# Altium project AWH6_V10.PrjPcb (part 1 of 3)
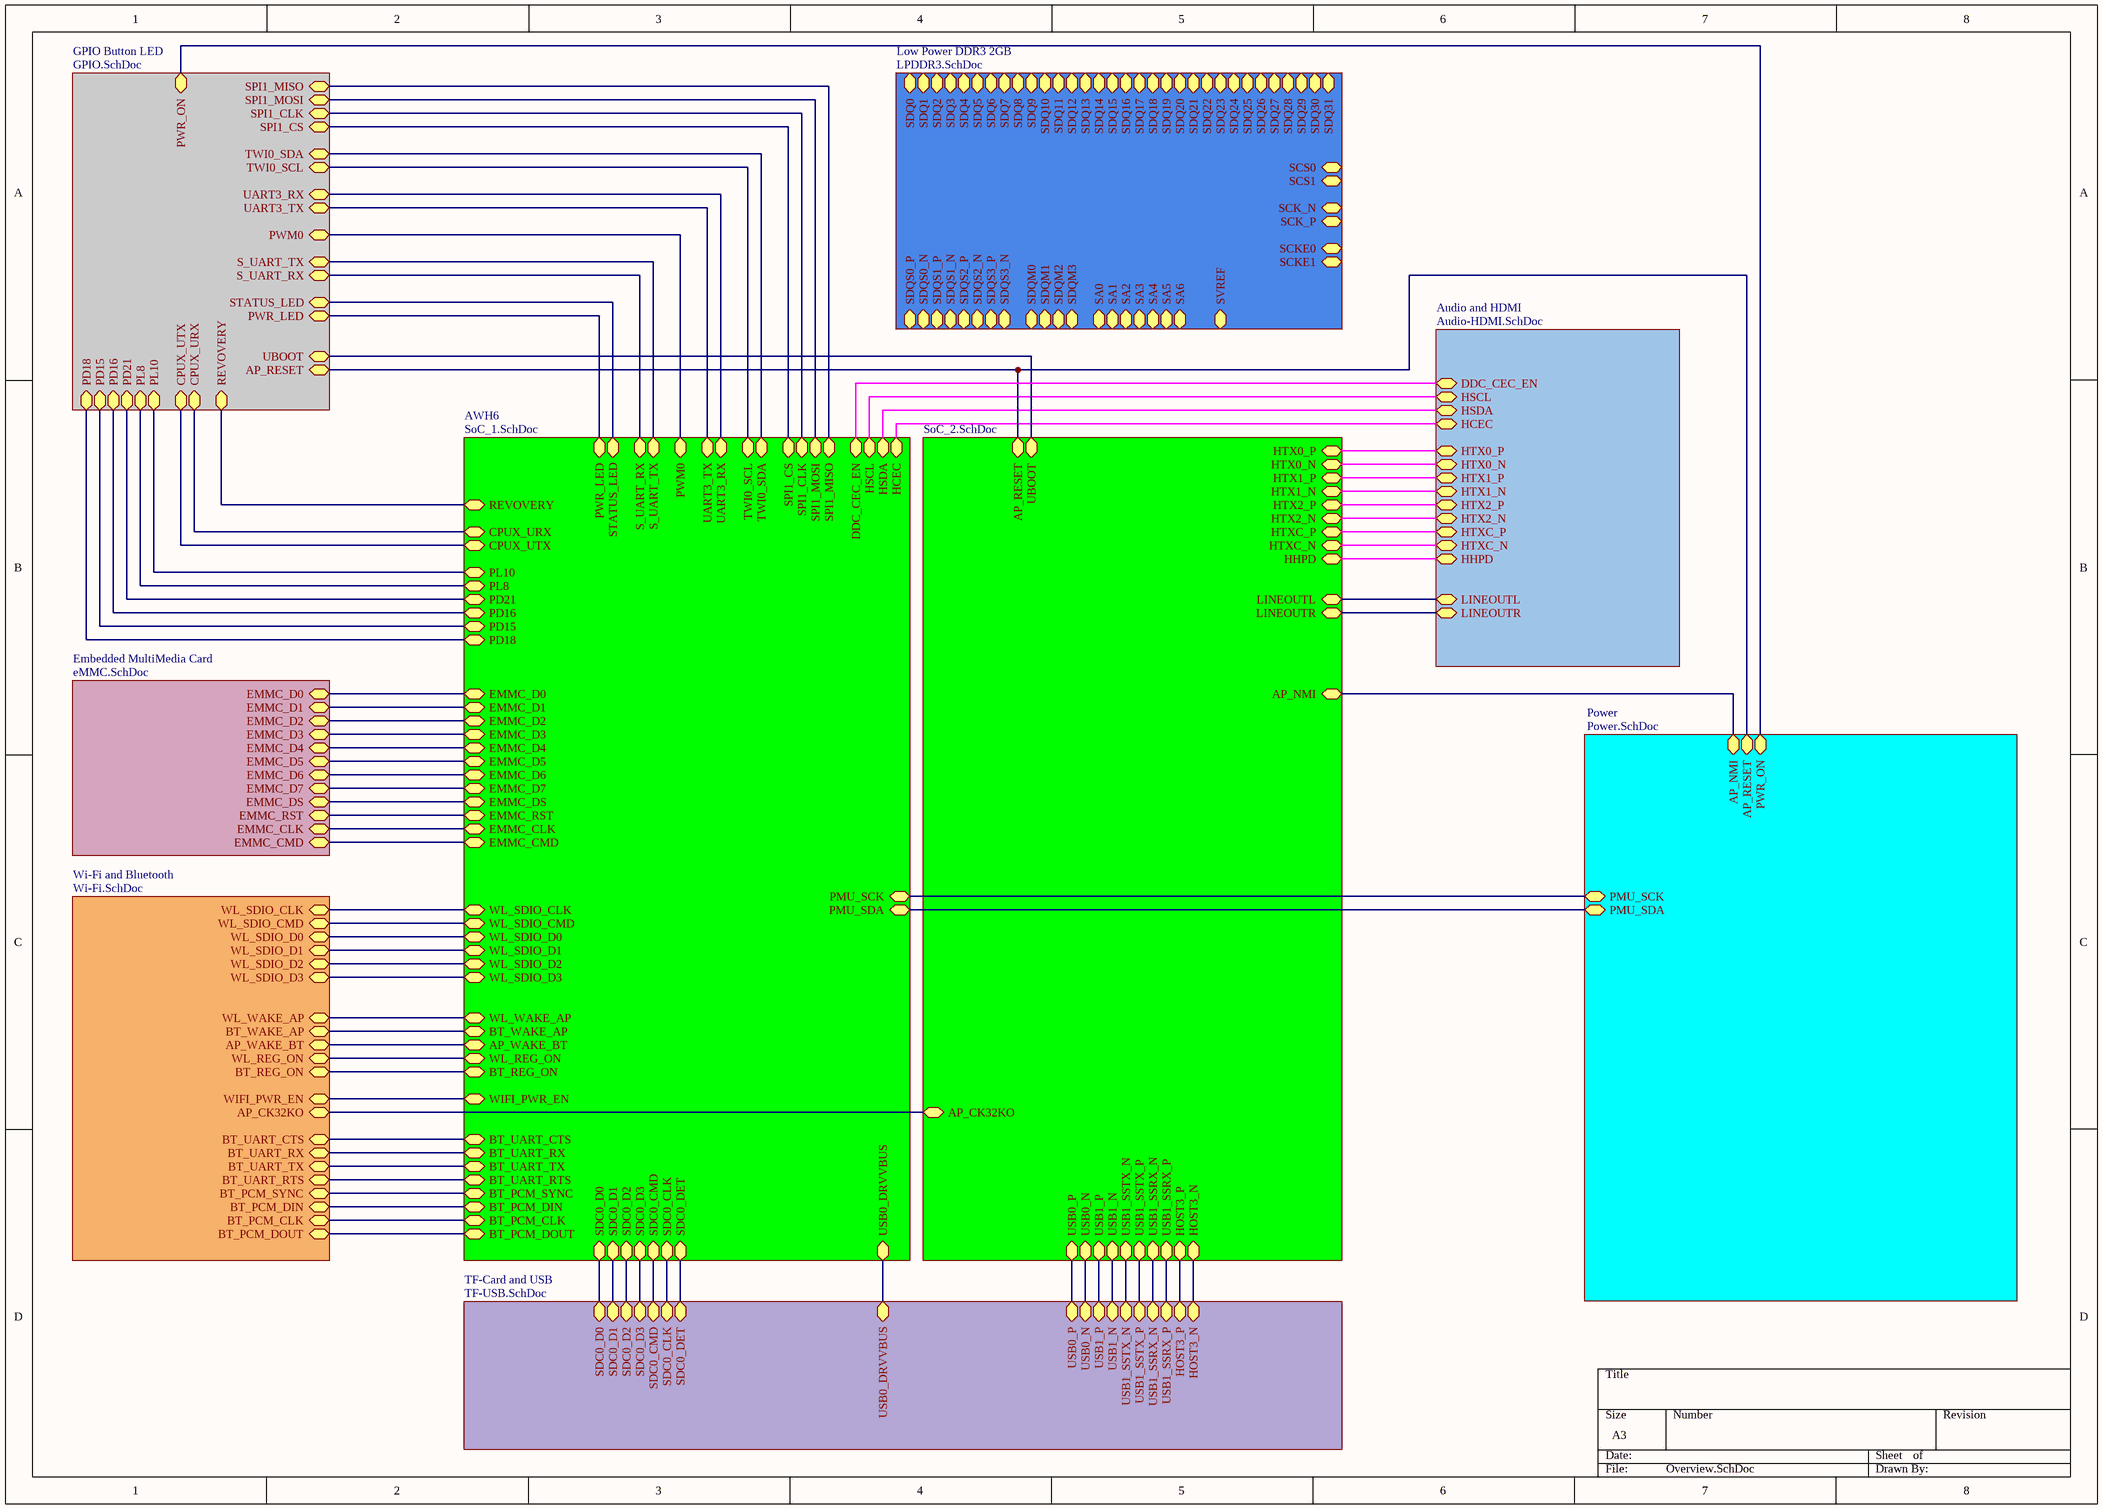
[diagram p0: Overview.SchDoc]
10 sheets, 321 parts. Net scope: global (net labels, ports and power ports of the same name join across sheets).
Board file: PCB1.PcbDoc
Sheets:
  Overview.SchDoc
    Low Power DDR3 2GB = LPDDR3.SchDoc
    AWH6 = SoC_1.SchDoc
    Embedded MultiMedia Card = eMMC.SchDoc
    Power = Power.SchDoc
    TF-Card and USB = TF-USB.SchDoc
    Audio and HDMI = Audio-HDMI.SchDoc
    Wi-Fi and Bluetooth = Wi-Fi.SchDoc
    U_MPU_2 = SoC_2.SchDoc
    GPIO Button LED = GPIO.SchDoc

## Sheet Overview.SchDoc
size A3; SheetNumber: 1; SheetTotal: 10

### Sub-sheets
Audio and HDMI = Audio-HDMI.SchDoc: DDC_CEC_EN (bidir), HSCL (bidir), HSDA (bidir), HCEC (bidir), LINEOUTL (bidir), LINEOUTR (bidir), HTX0_P (bidir), HTX0_N (bidir), HTX1_P (bidir), HTX1_N (bidir), HTX2_P (bidir), HTX2_N (bidir), HTXC_P (bidir), HTXC_N (bidir), HHPD (bidir)
AWH6 = SoC_1.SchDoc: DDC_CEC_EN (bidir), HSCL (bidir), HSDA (bidir), HCEC (bidir), WL_SDIO_CLK (bidir), WL_SDIO_CMD (bidir), WL_SDIO_D0 (bidir), WL_SDIO_D1 (bidir), WL_SDIO_D2 (bidir), WL_SDIO_D3 (bidir), WL_WAKE_AP (bidir), BT_WAKE_AP (bidir), AP_WAKE_BT (bidir), WL_REG_ON (bidir), BT_REG_ON (bidir), EMMC_D0 (bidir), EMMC_D1 (bidir), EMMC_D2 (bidir), EMMC_D3 (bidir), EMMC_D4 (bidir), EMMC_D5 (bidir), EMMC_D6 (bidir), EMMC_D7 (bidir), EMMC_DS (bidir), SDC0_D0 (bidir), SDC0_D1 (bidir), SDC0_D2 (bidir), SDC0_D3 (bidir), SDC0_CMD (bidir), SDC0_CLK (bidir), SDC0_DET (bidir), USB0_DRVVBUS (bidir), BT_UART_CTS (bidir), BT_UART_RX (bidir), BT_UART_TX (bidir), BT_UART_RTS (bidir), BT_PCM_SYNC (bidir), BT_PCM_DIN (bidir), BT_PCM_CLK (bidir), BT_PCM_DOUT (bidir), WIFI_PWR_EN (bidir), SPI1_MISO (bidir), SPI1_MOSI (bidir), SPI1_CLK (bidir), SPI1_CS (bidir), TWI0_SDA (bidir), TWI0_SCL (bidir), UART3_RX (bidir), UART3_TX (bidir), PWM0 (bidir), S_UART_TX (bidir), S_UART_RX (bidir), PD18 (bidir), PD15 (bidir), PD16 (bidir), PD21 (bidir), PL8 (bidir), PL10 (bidir), STATUS_LED (bidir), PWR_LED (bidir), CPUX_UTX (bidir), CPUX_URX (bidir), EMMC_RST (bidir), EMMC_CLK (bidir), EMMC_CMD (bidir), REVOVERY (bidir), PMU_SCK (bidir), PMU_SDA (bidir)
Embedded MultiMedia Card = eMMC.SchDoc: EMMC_D0 (bidir), EMMC_D1 (bidir), EMMC_D2 (bidir), EMMC_D3 (bidir), EMMC_D4 (bidir), EMMC_D5 (bidir), EMMC_D6 (bidir), EMMC_D7 (bidir), EMMC_DS (bidir), EMMC_CLK (bidir), EMMC_CMD (bidir), EMMC_RST (bidir)
GPIO Button LED = GPIO.SchDoc: PWM0 (bidir), TWI0_SCL (bidir), TWI0_SDA (bidir), UART3_RX (bidir), UART3_TX (bidir), SPI1_CS (bidir), SPI1_CLK (bidir), SPI1_MOSI (bidir), SPI1_MISO (bidir), S_UART_TX (bidir), S_UART_RX (bidir), PD18 (bidir), PD15 (bidir), PD16 (bidir), PD21 (bidir), PL8 (bidir), PL10 (bidir), STATUS_LED (bidir), PWR_LED (bidir), CPUX_UTX (bidir), CPUX_URX (bidir), REVOVERY (bidir), AP_RESET (bidir), UBOOT (bidir), PWR_ON (bidir)
Low Power DDR3 2GB = LPDDR3.SchDoc: SDQ0 (bidir), SDQ1 (bidir), SDQ2 (bidir), SDQ3 (bidir), SDQ4 (bidir), SDQ5 (bidir), SDQ6 (bidir), SDQ7 (bidir), SDQ8 (bidir), SDQ9 (bidir), SDQ10 (bidir), SDQ11 (bidir), SDQ12 (bidir), SDQ13 (bidir), SDQ14 (bidir), SDQ15 (bidir), SDQ16 (bidir), SDQ17 (bidir), SDQ18 (bidir), SDQ19 (bidir), SDQ20 (bidir), SDQ21 (bidir), SDQ22 (bidir), SDQ23 (bidir), SDQ24 (bidir), SDQ25 (bidir), SDQ26 (bidir), SDQ27 (bidir), SDQ28 (bidir), SDQ29 (bidir), SDQ30 (bidir), SDQ31 (bidir), SDQS0_P (bidir), SDQS0_N (bidir), SDQS1_P (bidir), SDQS1_N (bidir), SDQS2_P (bidir), SDQS2_N (bidir), SDQS3_P (bidir), SDQS3_N (bidir), SDQM0 (bidir), SDQM1 (bidir), SDQM2 (bidir), SDQM3 (bidir), SA0 (bidir), SA1 (bidir), SA2 (bidir), SA3 (bidir), SA4 (bidir), SA5 (bidir), SA6 (bidir), SCS0 (bidir), SCS1 (bidir), SCK_N (bidir), SCK_P (bidir), SCKE0 (bidir), SCKE1 (bidir), SVREF (bidir)
Power = Power.SchDoc: PWR_ON (bidir), AP_RESET (bidir), AP_NMI (bidir), PMU_SCK (bidir), PMU_SDA (bidir)
TF-Card and USB = TF-USB.SchDoc: SDC0_D0 (bidir), SDC0_D1 (bidir), SDC0_D2 (bidir), SDC0_D3 (bidir), SDC0_CMD (bidir), SDC0_CLK (bidir), SDC0_DET (bidir), USB1_P (bidir), USB0_N (bidir), USB0_P (bidir), USB1_N (bidir), USB1_SSTX_N (bidir), USB1_SSTX_P (bidir), USB1_SSRX_N (bidir), USB1_SSRX_P (bidir), HOST3_P (bidir), HOST3_N (bidir), USB0_DRVVBUS (bidir)
U_MPU_2 = SoC_2.SchDoc: LINEOUTL (bidir), LINEOUTR (bidir), HTX0_P (bidir), HTX0_N (bidir), HTX1_P (bidir), HTX1_N (bidir), HTX2_P (bidir), HTX2_N (bidir), HTXC_P (bidir), HTXC_N (bidir), HHPD (bidir), HOST3_N (bidir), HOST3_P (bidir), USB1_SSRX_P (bidir), USB1_SSRX_N (bidir), USB1_SSTX_P (bidir), USB1_SSTX_N (bidir), USB1_N (bidir), USB1_P (bidir), USB0_N (bidir), USB0_P (bidir), AP_RESET (bidir), UBOOT (bidir), AP_CK32KO (bidir), AP_NMI (bidir)
Wi-Fi and Bluetooth = Wi-Fi.SchDoc: WL_SDIO_CLK (bidir), WL_SDIO_CMD (bidir), WL_SDIO_D0 (bidir), WL_SDIO_D1 (bidir), WL_SDIO_D2 (bidir), WL_SDIO_D3 (bidir), BT_REG_ON (bidir), WL_REG_ON (bidir), AP_WAKE_BT (bidir), BT_WAKE_AP (bidir), WL_WAKE_AP (bidir), BT_UART_CTS (bidir), BT_UART_RX (bidir), BT_UART_TX (bidir), BT_UART_RTS (bidir), BT_PCM_SYNC (bidir), BT_PCM_DIN (bidir), BT_PCM_CLK (bidir), BT_PCM_DOUT (bidir), WIFI_PWR_EN (bidir), AP_CK32KO (bidir)

### Nets
(unnamed): sheet AWH6/DDC_CEC_EN, sheet Audio and HDMI/DDC_CEC_EN
(unnamed): sheet AWH6/HSCL, sheet Audio and HDMI/HSCL
(unnamed): sheet AWH6/HSDA, sheet Audio and HDMI/HSDA
(unnamed): sheet AWH6/HCEC, sheet Audio and HDMI/HCEC
(unnamed): sheet AWH6/WL_SDIO_CLK, sheet Wi-Fi and Bluetooth/WL_SDIO_CLK
(unnamed): sheet AWH6/WL_SDIO_CMD, sheet Wi-Fi and Bluetooth/WL_SDIO_CMD
(unnamed): sheet AWH6/WL_SDIO_D0, sheet Wi-Fi and Bluetooth/WL_SDIO_D0
(unnamed): sheet AWH6/WL_SDIO_D1, sheet Wi-Fi and Bluetooth/WL_SDIO_D1
(unnamed): sheet AWH6/WL_SDIO_D2, sheet Wi-Fi and Bluetooth/WL_SDIO_D2
(unnamed): sheet AWH6/WL_SDIO_D3, sheet Wi-Fi and Bluetooth/WL_SDIO_D3
(unnamed): sheet AWH6/WL_WAKE_AP, sheet Wi-Fi and Bluetooth/WL_WAKE_AP
(unnamed): sheet AWH6/BT_WAKE_AP, sheet Wi-Fi and Bluetooth/BT_WAKE_AP
(unnamed): sheet AWH6/AP_WAKE_BT, sheet Wi-Fi and Bluetooth/AP_WAKE_BT
(unnamed): sheet AWH6/WL_REG_ON, sheet Wi-Fi and Bluetooth/WL_REG_ON
(unnamed): sheet AWH6/BT_REG_ON, sheet Wi-Fi and Bluetooth/BT_REG_ON
(unnamed): sheet AWH6/EMMC_D0, sheet Embedded MultiMedia Card/EMMC_D0
(unnamed): sheet AWH6/EMMC_D1, sheet Embedded MultiMedia Card/EMMC_D1
(unnamed): sheet AWH6/EMMC_D2, sheet Embedded MultiMedia Card/EMMC_D2
(unnamed): sheet AWH6/EMMC_D3, sheet Embedded MultiMedia Card/EMMC_D3
(unnamed): sheet AWH6/EMMC_D4, sheet Embedded MultiMedia Card/EMMC_D4
(unnamed): sheet AWH6/EMMC_D5, sheet Embedded MultiMedia Card/EMMC_D5
(unnamed): sheet AWH6/EMMC_D6, sheet Embedded MultiMedia Card/EMMC_D6
(unnamed): sheet AWH6/EMMC_D7, sheet Embedded MultiMedia Card/EMMC_D7
(unnamed): sheet AWH6/EMMC_DS, sheet Embedded MultiMedia Card/EMMC_DS
(unnamed): sheet AWH6/SDC0_D0, sheet TF-Card and USB/SDC0_D0
(unnamed): sheet AWH6/SDC0_D1, sheet TF-Card and USB/SDC0_D1
(unnamed): sheet AWH6/SDC0_D2, sheet TF-Card and USB/SDC0_D2
(unnamed): sheet AWH6/SDC0_D3, sheet TF-Card and USB/SDC0_D3
(unnamed): sheet AWH6/SDC0_CMD, sheet TF-Card and USB/SDC0_CMD
(unnamed): sheet AWH6/SDC0_CLK, sheet TF-Card and USB/SDC0_CLK
(unnamed): sheet AWH6/SDC0_DET, sheet TF-Card and USB/SDC0_DET
(unnamed): sheet AWH6/USB0_DRVVBUS, sheet TF-Card and USB/USB0_DRVVBUS
(unnamed): sheet AWH6/BT_UART_CTS, sheet Wi-Fi and Bluetooth/BT_UART_CTS
(unnamed): sheet AWH6/BT_UART_RX, sheet Wi-Fi and Bluetooth/BT_UART_RX
(unnamed): sheet AWH6/BT_UART_TX, sheet Wi-Fi and Bluetooth/BT_UART_TX
(unnamed): sheet AWH6/BT_UART_RTS, sheet Wi-Fi and Bluetooth/BT_UART_RTS
(unnamed): sheet AWH6/BT_PCM_SYNC, sheet Wi-Fi and Bluetooth/BT_PCM_SYNC
(unnamed): sheet AWH6/BT_PCM_DIN, sheet Wi-Fi and Bluetooth/BT_PCM_DIN
(unnamed): sheet AWH6/BT_PCM_CLK, sheet Wi-Fi and Bluetooth/BT_PCM_CLK
(unnamed): sheet AWH6/BT_PCM_DOUT, sheet Wi-Fi and Bluetooth/BT_PCM_DOUT
(unnamed): sheet AWH6/WIFI_PWR_EN, sheet Wi-Fi and Bluetooth/WIFI_PWR_EN
(unnamed): sheet AWH6/SPI1_MISO, sheet GPIO Button LED/SPI1_MISO
(unnamed): sheet AWH6/SPI1_MOSI, sheet GPIO Button LED/SPI1_MOSI
(unnamed): sheet AWH6/SPI1_CLK, sheet GPIO Button LED/SPI1_CLK
(unnamed): sheet AWH6/SPI1_CS, sheet GPIO Button LED/SPI1_CS
(unnamed): sheet AWH6/TWI0_SDA, sheet GPIO Button LED/TWI0_SDA
(unnamed): sheet AWH6/TWI0_SCL, sheet GPIO Button LED/TWI0_SCL
(unnamed): sheet AWH6/UART3_RX, sheet GPIO Button LED/UART3_RX
(unnamed): sheet AWH6/UART3_TX, sheet GPIO Button LED/UART3_TX
(unnamed): sheet AWH6/PWM0, sheet GPIO Button LED/PWM0
(unnamed): sheet AWH6/S_UART_TX, sheet GPIO Button LED/S_UART_TX
(unnamed): sheet AWH6/S_UART_RX, sheet GPIO Button LED/S_UART_RX
(unnamed): sheet AWH6/PD18, sheet GPIO Button LED/PD18
(unnamed): sheet AWH6/PD15, sheet GPIO Button LED/PD15
(unnamed): sheet AWH6/PD16, sheet GPIO Button LED/PD16
(unnamed): sheet AWH6/PD21, sheet GPIO Button LED/PD21
(unnamed): sheet AWH6/PL8, sheet GPIO Button LED/PL8
(unnamed): sheet AWH6/PL10, sheet GPIO Button LED/PL10
(unnamed): sheet AWH6/STATUS_LED, sheet GPIO Button LED/STATUS_LED
(unnamed): sheet AWH6/PWR_LED, sheet GPIO Button LED/PWR_LED
(unnamed): sheet AWH6/CPUX_UTX, sheet GPIO Button LED/CPUX_UTX
(unnamed): sheet AWH6/CPUX_URX, sheet GPIO Button LED/CPUX_URX
(unnamed): sheet AWH6/EMMC_RST, sheet Embedded MultiMedia Card/EMMC_RST
(unnamed): sheet AWH6/EMMC_CLK, sheet Embedded MultiMedia Card/EMMC_CLK
(unnamed): sheet AWH6/EMMC_CMD, sheet Embedded MultiMedia Card/EMMC_CMD
(unnamed): sheet AWH6/REVOVERY, sheet GPIO Button LED/REVOVERY
(unnamed): sheet AWH6/PMU_SCK, sheet Power/PMU_SCK
(unnamed): sheet AWH6/PMU_SDA, sheet Power/PMU_SDA
(unnamed): sheet Power/PWR_ON, sheet GPIO Button LED/PWR_ON
(unnamed): sheet Power/AP_RESET, sheet U_MPU_2/AP_RESET, sheet GPIO Button LED/AP_RESET
(unnamed): sheet Power/AP_NMI, sheet U_MPU_2/AP_NMI
(unnamed): sheet TF-Card and USB/USB1_P, sheet U_MPU_2/USB1_P
(unnamed): sheet TF-Card and USB/USB0_N, sheet U_MPU_2/USB0_N
(unnamed): sheet TF-Card and USB/USB0_P, sheet U_MPU_2/USB0_P
(unnamed): sheet TF-Card and USB/USB1_N, sheet U_MPU_2/USB1_N
(unnamed): sheet TF-Card and USB/USB1_SSTX_N, sheet U_MPU_2/USB1_SSTX_N
(unnamed): sheet TF-Card and USB/USB1_SSTX_P, sheet U_MPU_2/USB1_SSTX_P
(unnamed): sheet TF-Card and USB/USB1_SSRX_N, sheet U_MPU_2/USB1_SSRX_N
(unnamed): sheet TF-Card and USB/USB1_SSRX_P, sheet U_MPU_2/USB1_SSRX_P
(unnamed): sheet TF-Card and USB/HOST3_P, sheet U_MPU_2/HOST3_P
(unnamed): sheet TF-Card and USB/HOST3_N, sheet U_MPU_2/HOST3_N
(unnamed): sheet Audio and HDMI/LINEOUTL, sheet U_MPU_2/LINEOUTL
(unnamed): sheet Audio and HDMI/LINEOUTR, sheet U_MPU_2/LINEOUTR
(unnamed): sheet Audio and HDMI/HTX0_P, sheet U_MPU_2/HTX0_P
(unnamed): sheet Audio and HDMI/HTX0_N, sheet U_MPU_2/HTX0_N
(unnamed): sheet Audio and HDMI/HTX1_P, sheet U_MPU_2/HTX1_P
(unnamed): sheet Audio and HDMI/HTX1_N, sheet U_MPU_2/HTX1_N
(unnamed): sheet Audio and HDMI/HTX2_P, sheet U_MPU_2/HTX2_P
(unnamed): sheet Audio and HDMI/HTX2_N, sheet U_MPU_2/HTX2_N
(unnamed): sheet Audio and HDMI/HTXC_P, sheet U_MPU_2/HTXC_P
(unnamed): sheet Audio and HDMI/HTXC_N, sheet U_MPU_2/HTXC_N
(unnamed): sheet Audio and HDMI/HHPD, sheet U_MPU_2/HHPD
(unnamed): sheet Wi-Fi and Bluetooth/AP_CK32KO, sheet U_MPU_2/AP_CK32KO
(unnamed): sheet U_MPU_2/UBOOT, sheet GPIO Button LED/UBOOT

## Sheet LPDDR3.SchDoc
size A3; SheetNumber: 2; SheetTotal: 10
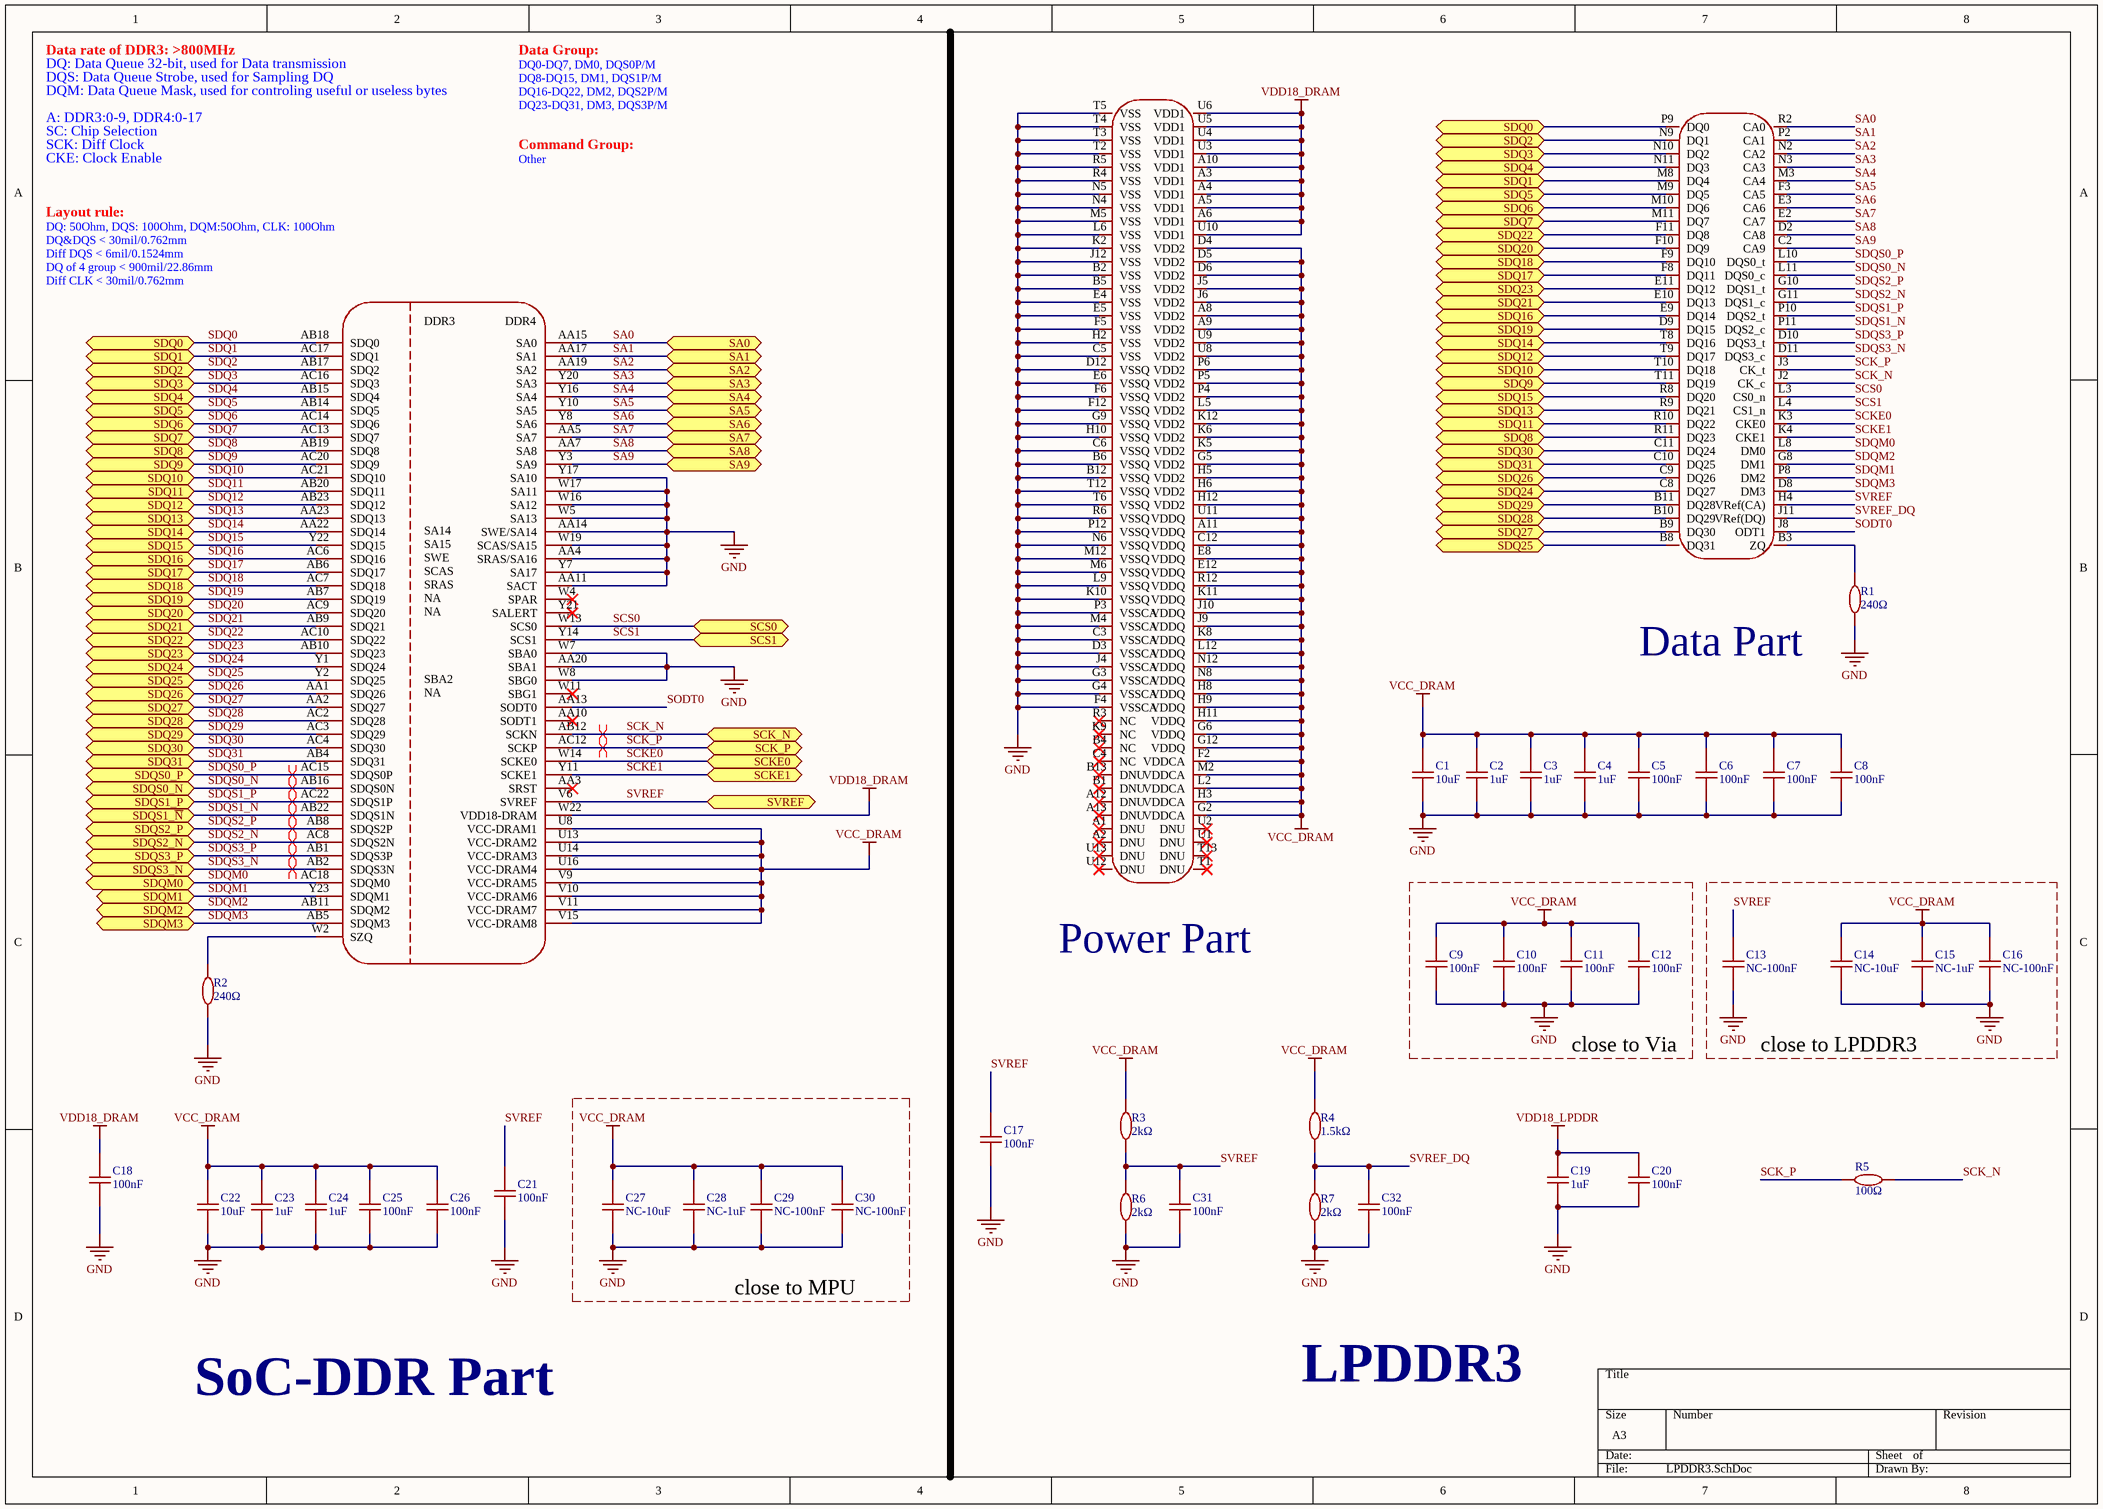
[diagram p1: LPDDR3.SchDoc]

### Parts
C1  10uF  [C0603]
C2  1uF  [C0402]
C3  1uF  [C0402]
C4  1uF  [C0402]
C5  100nF  [C0402]
C6  100nF  [C0402]
C7  100nF  [C0402]
C8  100nF  [C0402]
C9  100nF  [C0402]
C10  100nF  [C0402]
C11  100nF  [C0402]
C12  100nF  [C0402]
C13  NC-100nF  [C0402]
C14  NC-10uF  [C0603]
C15  NC-1uF  [C0402]
C16  NC-100nF  [C0402]
C17  100nF  [C0402]
C18  100nF  [C0402]
C19  1uF  [C0402]
C20  100nF  [C0402]
C21  100nF  [C0402]
C22  10uF  [C0603]
C23  1uF  [C0402]
C24  1uF  [C0402]
C25  100nF  [C0402]
C26  100nF  [C0402]
C27  NC-10uF  [C0603]
C28  NC-1uF  [C0402]
C29  NC-100nF  [C0402]
C30  NC-100nF  [C0402]
C31  100nF  [C0402]
C32  100nF  [C0402]
R1  240Ω  [R0402]
R2  240Ω  [R0402]
R3  2kΩ  [R0402]
R4  1.5kΩ  [R0402]
R5  100Ω  [R0402]
R6  2kΩ  [R0402]
R7  2kΩ  [R0402]
U1  LPDDR3-2G  [FBGA-178_L11.5-W11.0_K4E6E304EC-TL]  (value not drawn)  (parts A,B of 2)
U2  Allwinner_H6  [BGA451_ALLWINNER_H6]  (value not drawn)  (part A of 4)

### Blocks framed on the sheet
close to Via: C9-C12
close to LPDDR3: C13-C16
close to MPU: C27-C30

### Ports
SA0 (bidir), SA1 (bidir), SA2 (bidir), SA3 (bidir), SA4 (bidir), SA5 (bidir), SA6 (bidir), SA7 (bidir), SA8 (bidir), SA9 (bidir), SCK_N (bidir), SCK_P (bidir), SCKE0 (bidir), SCKE1 (bidir), SCS0 (bidir), SCS1 (bidir), SDQ0 (bidir, see LPDDR3[1A]), SDQ0 (bidir, see LPDDR3[6A]), SDQ1 (bidir, see LPDDR3[1A]), SDQ1 (bidir, see LPDDR3[6A]), SDQ2 (bidir, see LPDDR3[1A]), SDQ2 (bidir, see LPDDR3[6A]), SDQ3 (bidir, see LPDDR3[1B]), SDQ3 (bidir, see LPDDR3[6A]), SDQ4 (bidir, see LPDDR3[1B]), SDQ4 (bidir, see LPDDR3[6A]), SDQ5 (bidir, see LPDDR3[1B]), SDQ5 (bidir, see LPDDR3[6A]), SDQ6 (bidir, see LPDDR3[1B]), SDQ6 (bidir, see LPDDR3[6A]), SDQ7 (bidir, see LPDDR3[1B]), SDQ7 (bidir, see LPDDR3[6A]), SDQ8 (bidir, see LPDDR3[1B]), SDQ8 (bidir, see LPDDR3[6B]), SDQ9 (bidir, see LPDDR3[1B]), SDQ9 (bidir, see LPDDR3[6B]), SDQ10 (bidir, see LPDDR3[1B]), SDQ10 (bidir, see LPDDR3[6A]), SDQ11 (bidir, see LPDDR3[1B]), SDQ11 (bidir, see LPDDR3[6B]), SDQ12 (bidir, see LPDDR3[1B]), SDQ12 (bidir, see LPDDR3[6A]), SDQ13 (bidir, see LPDDR3[1B]), SDQ13 (bidir, see LPDDR3[6B]), SDQ14 (bidir, see LPDDR3[1B]), SDQ14 (bidir, see LPDDR3[6A]), SDQ15 (bidir, see LPDDR3[1B]), SDQ15 (bidir, see LPDDR3[6B]), SDQ16 (bidir, see LPDDR3[1B]), SDQ16 (bidir, see LPDDR3[6A]), SDQ17 (bidir, see LPDDR3[1B]), SDQ17 (bidir, see LPDDR3[6A]), SDQ18 (bidir, see LPDDR3[1B]), SDQ18 (bidir, see LPDDR3[6A]), SDQ19 (bidir, see LPDDR3[1B]), SDQ19 (bidir, see LPDDR3[6A]), SDQ20 (bidir, see LPDDR3[1B]), SDQ20 (bidir, see LPDDR3[6A]), SDQ21 (bidir, see LPDDR3[1B]), SDQ21 (bidir, see LPDDR3[6A]), SDQ22 (bidir, see LPDDR3[1B]), SDQ22 (bidir, see LPDDR3[6A]), SDQ23 (bidir, see LPDDR3[1B]), SDQ23 (bidir, see LPDDR3[6A]), SDQ24 (bidir, see LPDDR3[1B]), SDQ24 (bidir, see LPDDR3[6B]), SDQ25 (bidir, see LPDDR3[1B]), SDQ25 (bidir, see LPDDR3[6B]), SDQ26 (bidir, see LPDDR3[1B]), SDQ26 (bidir, see LPDDR3[6B]), SDQ27 (bidir, see LPDDR3[1B]), SDQ27 (bidir, see LPDDR3[6B]), SDQ28 (bidir, see LPDDR3[1B]), SDQ28 (bidir, see LPDDR3[6B]), SDQ29 (bidir, see LPDDR3[1B]), SDQ29 (bidir, see LPDDR3[6B]), SDQ30 (bidir, see LPDDR3[1B]), SDQ30 (bidir, see LPDDR3[6B]), SDQ31 (bidir, see LPDDR3[1C]), SDQ31 (bidir, see LPDDR3[6B]), SDQM0 (bidir), SDQM1 (bidir), SDQM2 (bidir), SDQM3 (bidir), SDQS0_N (bidir), SDQS0_P (bidir), SDQS1_P (bidir), SDQS1_~{N} (bidir), SDQS2_N (bidir), SDQS2_P (bidir), SDQS3_N (bidir), SDQS3_P (bidir), SVREF (bidir)

### Nets
GND: C1.1 C2.1 C3.1 C4.1 C5.1 C6.1 C7.1 C8.1 C9.1 C10.1 C11.1 C12.1 C13.1 C14.1 C15.1 C16.1 C17.1 C18.1 C19.1 C20.1 C21.1 C22.1 C23.1 C24.1 C25.1 C26.1 C27.1 C28.1 C29.1 C30.1 C31.1 C32.1 R1.1 R2.1 R6.1 R7.1 U1.B2(VSS) U1.B5(VSS) U1.B6(VSSQ) U1.B12(VSSQ) U1.C3(VSSCA) U1.C5(VSS) U1.C6(VSSQ) U1.D3(VSSCA) U1.D12(VSSQ) U1.E4(VSS) U1.E5(VSS) U1.E6(VSSQ) U1.F4(VSSCA) U1.F5(VSS) U1.F6(VSSQ) U1.F12(VSSQ) U1.G3(VSSCA) U1.G4(VSSCA) U1.G9(VSSQ) U1.H2(VSS) U1.H10(VSSQ) U1.J4(VSSCA) U1.J12(VSS) U1.K2(VSS) U1.K10(VSSQ) U1.L6(VSS) U1.L9(VSSQ) U1.M4(VSSCA) U1.M5(VSS) U1.M6(VSSQ) U1.M12(VSSQ) U1.N4(VSS) U1.N5(VSS) U1.N6(VSSQ) U1.P3(VSSCA) U1.P12(VSSQ) U1.R4(VSS) U1.R5(VSS) U1.R6(VSSQ) U1.T2(VSS) U1.T3(VSS) U1.T4(VSS) U1.T5(VSS) U1.T6(VSSQ) U1.T12(VSSQ) U2.AA4(SRAS/SA16) U2.AA11(SACT) U2.AA14(SWE/SA14) U2.AA20(SBA1) U2.W5(SA13) U2.W7(SBA0) U2.W8(SBG0) U2.W16(SA12) U2.W17(SA11) U2.W19(SCAS/SA15) U2.Y7(SA17) U2.Y17(SA10)
VCC_DRAM: C1.2 C2.2 C3.2 C4.2 C5.2 C6.2 C7.2 C8.2 C9.2 C10.2 C11.2 C12.2 C14.2 C15.2 C16.2 C22.2 C23.2 C24.2 C25.2 C26.2 C27.2 C28.2 C29.2 C30.2 R3.2 R4.2 U1.A8(VDD2) U1.A9(VDD2) U1.A11(VDDQ) U1.C12(VDDQ) U1.D4(VDD2) U1.D5(VDD2) U1.D6(VDD2) U1.E8(VDDQ) U1.E12(VDDQ) U1.F2(VDDCA) U1.G2(VDDCA) U1.G5(VDD2) U1.G6(VDDQ) U1.G12(VDDQ) U1.H3(VDDCA) U1.H5(VDD2) U1.H6(VDD2) U1.H8(VDDQ) U1.H9(VDDQ) U1.H11(VDDQ) U1.H12(VDD2) U1.J5(VDD2) U1.J6(VDD2) U1.J9(VDDQ) U1.J10(VDDQ) U1.K5(VDD2) U1.K6(VDD2) U1.K8(VDDQ) U1.K11(VDDQ) U1.K12(VDD2) U1.L2(VDDCA) U1.L5(VDD2) U1.L12(VDDQ) U1.M2(VDDCA) U1.N8(VDDQ) U1.N12(VDDQ) U1.P4(VDD2) U1.P5(VDD2) U1.P6(VDD2) U1.R12(VDDQ) U1.U8(VDD2) U1.U9(VDD2) U1.U11(VDDQ) U2.U8(VCC-DRAM1) U2.U13(VCC-DRAM2) U2.U14(VCC-DRAM3) U2.U16(VCC-DRAM4) U2.V9(VCC-DRAM5) U2.V10(VCC-DRAM6) U2.V11(VCC-DRAM7) U2.V15(VCC-DRAM8)
VDD18_DRAM: C18.2 U1.A3(VDD1) U1.A4(VDD1) U1.A5(VDD1) U1.A6(VDD1) U1.A10(VDD1) U1.U3(VDD1) U1.U4(VDD1) U1.U5(VDD1) U1.U6(VDD1) U1.U10(VDD1) U2.W22(VDD18-DRAM)  [project net BLDO1]
VDD18_LPDDR: C19.2 C20.2
SA0: U1.R2(CA0) U2.AA15(SA0) ; port SA0
SA1: U1.P2(CA1) U2.AA17(SA1) ; port SA1
SA2: U1.N2(CA2) U2.AA19(SA2) ; port SA2
SA3: U1.N3(CA3) U2.Y20(SA3) ; port SA3
SA4: U1.M3(CA4) U2.Y16(SA4) ; port SA4
SA5: U1.F3(CA5) U2.Y10(SA5) ; port SA5
SA6: U1.E3(CA6) U2.Y8(SA6) ; port SA6
SA7: U1.E2(CA7) U2.AA5(SA7) ; port SA7
SA8: U1.D2(CA8) U2.AA7(SA8) ; port SA8
SA9: U1.C2(CA9) U2.Y3(SA9) ; port SA9
SCK_N: R5.2 U1.J2(CK_c) U2.AB12(SCKN) ; port SCK_N
SCK_P: R5.1 U1.J3(CK_t) U2.AC12(SCKP) ; port SCK_P
SCKE0: U1.K3(CKE0) U2.W14(SCKE0) ; port SCKE0
SCKE1: U1.K4(CKE1) U2.Y11(SCKE1) ; port SCKE1
SCS0: U1.L3(CS0_n) U2.W13(SCS0) ; port SCS0
SCS1: U1.L4(CS1_n) U2.Y14(SCS1) ; port SCS1
SDQ0: U1.P9(DQ0) U2.AB18(SDQ0) ; port SDQ0
SDQ1: U1.M8(DQ4) U2.AC17(SDQ1) ; port SDQ1
SDQ2: U1.N9(DQ1) U2.AB17(SDQ2) ; port SDQ2
SDQ3: U1.N10(DQ2) U2.AC16(SDQ3) ; port SDQ3
SDQ4: U1.N11(DQ3) U2.AB15(SDQ4) ; port SDQ4
SDQ5: U1.M9(DQ5) U2.AB14(SDQ5) ; port SDQ5
SDQ6: U1.M10(DQ6) U2.AC14(SDQ6) ; port SDQ6
SDQ7: U1.M11(DQ7) U2.AC13(SDQ7) ; port SDQ7
SDQ8: U1.R11(DQ23) U2.AB19(SDQ8) ; port SDQ8
SDQ9: U1.T11(DQ19) U2.AC20(SDQ9) ; port SDQ9
SDQ10: U1.T10(DQ18) U2.AC21(SDQ10) ; port SDQ10
SDQ11: U1.R10(DQ22) U2.AB20(SDQ11) ; port SDQ11
SDQ12: U1.T9(DQ17) U2.AB23(SDQ12) ; port SDQ12
SDQ13: U1.R9(DQ21) U2.AA23(SDQ13) ; port SDQ13
SDQ14: U1.T8(DQ16) U2.AA22(SDQ14) ; port SDQ14
SDQ15: U1.R8(DQ20) U2.Y22(SDQ15) ; port SDQ15
SDQ16: U1.E9(DQ14) U2.AC6(SDQ16) ; port SDQ16
SDQ17: U1.F8(DQ11) U2.AB6(SDQ17) ; port SDQ17
SDQ18: U1.F9(DQ10) U2.AC7(SDQ18) ; port SDQ18
SDQ19: U1.D9(DQ15) U2.AB7(SDQ19) ; port SDQ19
SDQ20: U1.F10(DQ9) U2.AC9(SDQ20) ; port SDQ20
SDQ21: U1.E10(DQ13) U2.AB9(SDQ21) ; port SDQ21
SDQ22: U1.F11(DQ8) U2.AC10(SDQ22) ; port SDQ22
SDQ23: U1.E11(DQ12) U2.AB10(SDQ23) ; port SDQ23
SDQ24: U1.C8(DQ27) U2.Y1(SDQ24) ; port SDQ24
SDQ25: U1.B8(DQ31) U2.Y2(SDQ25) ; port SDQ25
SDQ26: U1.C9(DQ26) U2.AA1(SDQ26) ; port SDQ26
SDQ27: U1.B9(DQ30) U2.AA2(SDQ27) ; port SDQ27
SDQ28: U1.B10(DQ29) U2.AC2(SDQ28) ; port SDQ28
SDQ29: U1.B11(DQ28) U2.AC3(SDQ29) ; port SDQ29
SDQ30: U1.C11(DQ24) U2.AC4(SDQ30) ; port SDQ30
SDQ31: U1.C10(DQ25) U2.AB4(SDQ31) ; port SDQ31
SDQM0: U1.L8(DM0) U2.AC18(SDQM0) ; port SDQM0
SDQM1: U1.P8(DM2) U2.Y23(SDQM1) ; port SDQM1
SDQM2: U1.G8(DM1) U2.AB11(SDQM2) ; port SDQM2
SDQM3: U1.D8(DM3) U2.AB5(SDQM3) ; port SDQM3
SDQS0_N: U1.L11(DQS0_c) U2.AB16(SDQS0N) ; port SDQS0_N
SDQS0_P: U1.L10(DQS0_t) U2.AC15(SDQS0P) ; port SDQS0_P
SDQS1_N: U1.P11(DQS2_c) U2.AB22(SDQS1N) ; port SDQS1_~{N}
SDQS1_P: U1.P10(DQS2_t) U2.AC22(SDQS1P) ; port SDQS1_P
SDQS2_N: U1.G11(DQS1_c) U2.AC8(SDQS2N) ; port SDQS2_N
SDQS2_P: U1.G10(DQS1_t) U2.AB8(SDQS2P) ; port SDQS2_P
SDQS3_N: U1.D11(DQS3_c) U2.AB2(SDQS3N) ; port SDQS3_N
SDQS3_P: U1.D10(DQS3_t) U2.AB1(SDQS3P) ; port SDQS3_P
SODT0: U1.J8(ODT1) U2.AA13(SODT0)
SVREF: C13.2 C17.2 C21.2 C31.2 R3.1 R6.2 U1.H4(VRef(CA)) U2.V6(SVREF) ; port SVREF
SVREF_DQ: C32.2 R4.1 R7.2 U1.J11(VRef(DQ))
NetR1_2: R1.2 U1.B3(ZQ)
NetR2_2: R2.2 U2.W2(SZQ)

Not connected (* = marked no-connect by the designer): U1 A1(DNU)* A2(DNU)* A12(DNU)* A13(DNU)* B1(DNU)* B4(NC)* B13(DNU)* C4(NC)* K9(NC)* R3(NC)* T1(DNU)* T13(DNU)* U1(DNU)* U2(DNU)* U12(DNU)* U13(DNU)*; U2 AA3(SRST)* AA10(SODT1)* W4(SPAR)* W11(SBG1)* Y21(SALERT)*

### Layout directives
differential pair: SCK_N, SCK_P, SDQS0_N, SDQS0_P, SDQS1_N, SDQS1_P, SDQS2_N, SDQS2_P, SDQS3_N, SDQS3_P

### Notes on the sheet
- DQ: Data Queue 32-bit, used for Data transmission
- DQS: Data Queue Strobe, used for Sampling DQ
- Data rate of DDR3: >800MHz
- DQM: Data Queue Mask, used for controling useful or useless bytes
- DQ0-DQ7, DM0, DQS0P/M
- Data Group:
- DQ8-DQ15, DM1, DQS1P/M
- DQ16-DQ22, DM2, DQS2P/M
- DQ23-DQ31, DM3, DQS3P/M
- SC: Chip Selection
- A: DDR3:0-9, DDR4:0-17
- SCK: Diff Clock
- CKE: Clock Enable
- Other
- Command Group:
- DQ: 50Ohm, DQS: 100Ohm, DQM:50Ohm, CLK: 100Ohm
- DQ&DQS < 30mil/0.762mm
- Layout rule:
- Diff DQS < 6mil/0.1524mm
- DQ of 4 group < 900mil/22.86mm
- Diff CLK < 30mil/0.762mm
- (near R1) Data Part
- (near U1) Power Part
- LPDDR3
- SoC-DDR Part
- (in symbol Allwinner_H6, part A) DDR3; DDR4; SA14; SA15; SWE; SCAS; SRAS; NA; SBA2

### Library data of the parts
C1 C14 C22 C27 = 10uF: 10V 10uF X5R ±10% 0603 Ceramic Capacitors ROHS
C2-C4 C15 C19 C23 C24 C28 = 1uF: 50V 1uF X5R ±10% 0603 Ceramic Capacitors ROHS
C5-C13 C16-C18 C20 C21 C25 C26 C29 C30 = 100nF: 50V 100nF X7R ±10% 0603 Ceramic Capacitors ROHS
C31 C32 = 100nF: 50V 100nF X7R ±10% 0402 Ceramic Capacitors ROHS
R1 R2 = 240Ω: 240Ω 62.5mW 50V ±100ppm/℃ Thick Film Resistor ±1% 0402 Chip Resistor - Surface Mount ROHS
R3 R6 R7 = 2kΩ: 100mW 2kΩ 75V ±100ppm/℃ Thick Film Resistor ±1% 0402 Chip Resistor - Surface Mount ROHS
R4 = 1.5kΩ: 62.5mW 1.5kΩ 50V ±100ppm/℃ Thick Film Resistor ±1% 0402 Chip Resistor - Surface Mount ROHS
R5 = 100Ω: 100Ω 62.5mW 50V ±100ppm/℃ Thick Film Resistor ±1% 0402 Chip Resistor - Surface Mount ROHS
U1 = LPDDR3-2G: Manufacturer: SAMSUNG(三星半导体); Symbol: K4E6E304EC-EGCG; Add into BOM: yes; Device: LPDDR3-2G; LCSC Part Name: K4E6E304EC-EGCG; Supplier Part: C2803256; Manufacturer Part: K4E6E304EC-EGCG; Supplier Footprint: SMD; JLCPCB Part Class: 扩展库; Datasheet: https://atta.szlcsc.comnull; Supplier: LCSC; Convert to PCB: yes
U2 = Allwinner_H6: Add into BOM: yes; Symbol: Allwinner_H6; Device: Allwinner_H6; Convert to PCB: yes

## Sheet SoC_1.SchDoc
size A3; SheetNumber: 5; SheetTotal: 10
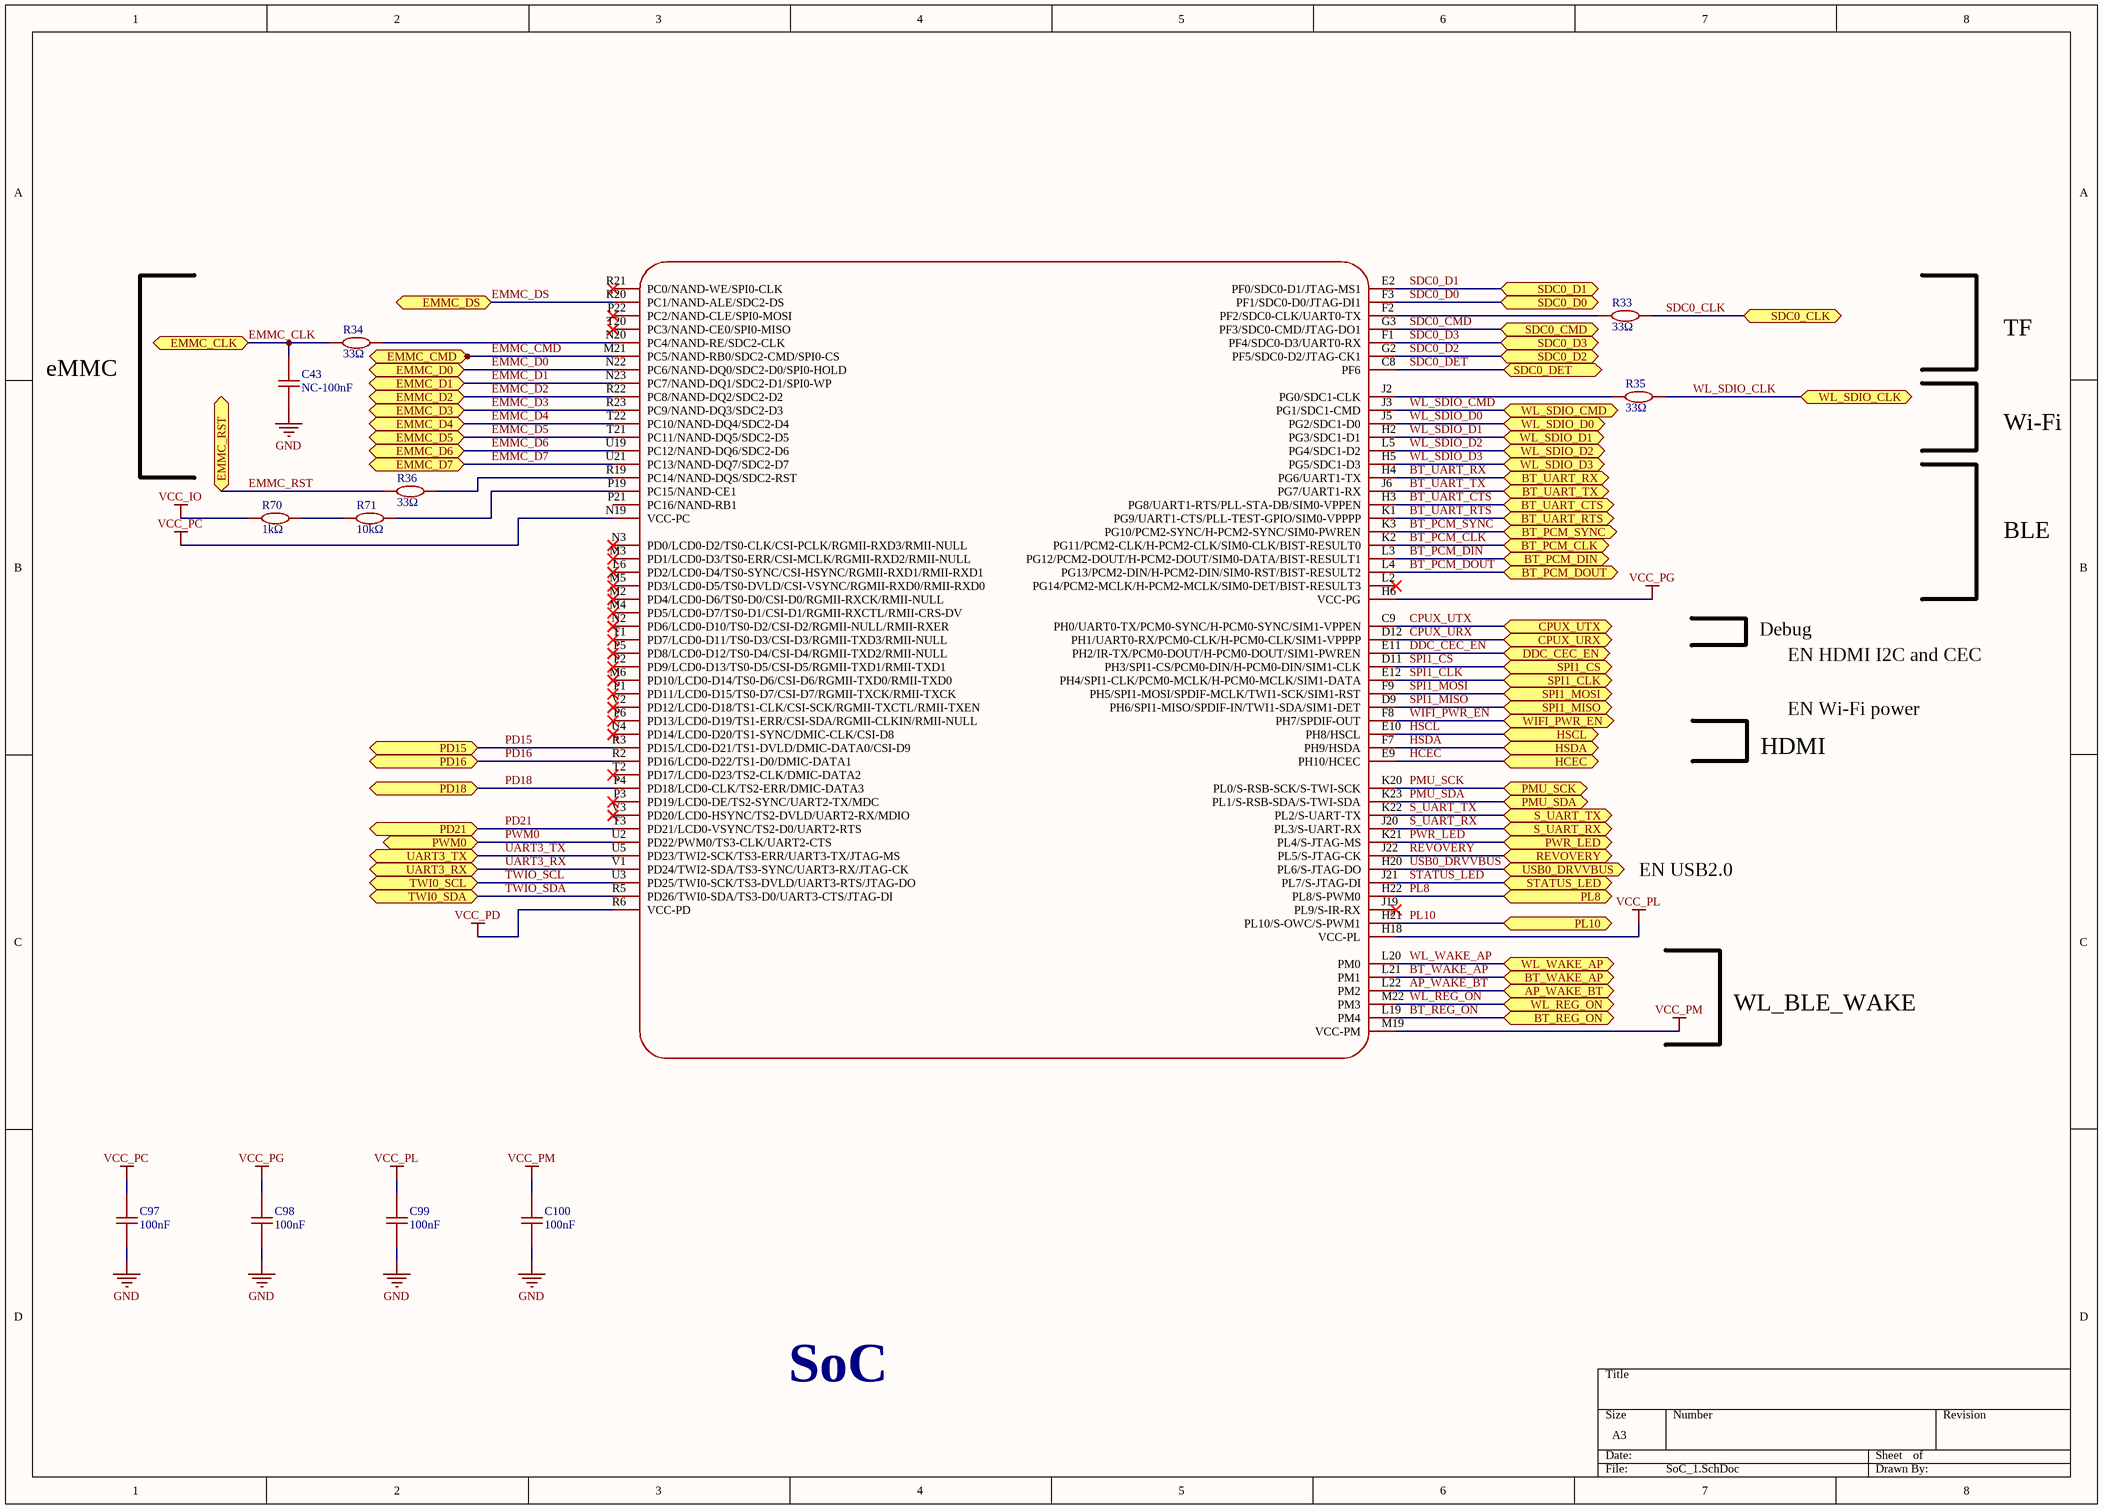
[diagram p2: SoC_1.SchDoc]

### Parts
C43  NC-100nF  [C0402]
C97  100nF  [C0402]
C98  100nF  [C0402]
C99  100nF  [C0402]
C100  100nF  [C0402]
R33  33Ω  [R0402]
R34  33Ω  [R0402]
R35  33Ω  [R0402]
R36  33Ω  [R0402]
R70  1kΩ  [R0402]
R71  10kΩ  [R0402]
U2  Allwinner_H6  [BGA451_ALLWINNER_H6]  (value not drawn)  (part B of 4)

### Ports
AP_WAKE_BT (bidir, see Wi-Fi[2B]), BT_PCM_CLK (bidir, see Wi-Fi[5B]), BT_PCM_DIN (bidir, see Wi-Fi[5B]), BT_PCM_DOUT (bidir, see Wi-Fi[5B]), BT_PCM_SYNC (bidir, see Wi-Fi[5B]), BT_REG_ON (bidir, see Wi-Fi[5B]), BT_UART_CTS (bidir, see Wi-Fi[5B]), BT_UART_RTS (bidir, see Wi-Fi[5B]), BT_UART_RX (bidir, see Wi-Fi[5B]), BT_UART_TX (bidir, see Wi-Fi[5B]), BT_WAKE_AP (bidir, see Wi-Fi[2B]), CPUX_URX (bidir, see GPIO[6A]), CPUX_UTX (bidir, see GPIO[6A]), DDC_CEC_EN (bidir, see Audio-HDMI[1C]), EMMC_CLK (bidir, see eMMC[3A]), EMMC_CMD (bidir, see eMMC[3A]), EMMC_D0 (bidir, see eMMC[3A]), EMMC_D1 (bidir, see eMMC[3A]), EMMC_D2 (bidir, see eMMC[3A]), EMMC_D3 (bidir, see eMMC[3A]), EMMC_D4 (bidir, see eMMC[3A]), EMMC_D5 (bidir, see eMMC[3A]), EMMC_D6 (bidir, see eMMC[3A]), EMMC_D7 (bidir, see eMMC[3A]), EMMC_DS (bidir, see eMMC[3A]), EMMC_RST (bidir, see eMMC[3A]), HCEC (bidir, see Audio-HDMI[2D]), HSCL (bidir, see Audio-HDMI[2C]), HSDA (bidir, see Audio-HDMI[2C]), PD15 (bidir, see GPIO[4A]), PD16 (bidir, see GPIO[4A]), PD18 (bidir, see GPIO[4A]), PD21 (bidir, see GPIO[4B]), PL8 (bidir, see GPIO[4B]), PL10 (bidir, see GPIO[1A]), PMU_SCK (bidir, see Power[4B]), PMU_SDA (bidir, see Power[4B]), PWM0 (bidir, see GPIO[1A]), PWR_LED (bidir, see GPIO[1C]), REVOVERY (bidir, see GPIO[8C]), S_UART_RX (bidir, see GPIO[4A]), S_UART_TX (bidir, see GPIO[4A]), SDC0_CLK (bidir, see TF-USB[1A]), SDC0_CMD (bidir, see TF-USB[1A]), SDC0_D0 (bidir, see TF-USB[1A]), SDC0_D1 (bidir, see TF-USB[1A]), SDC0_D2 (bidir, see TF-USB[1A]), SDC0_D3 (bidir, see TF-USB[1A]), SDC0_DET (bidir, see TF-USB[3B]), SPI1_CLK (bidir, see GPIO[1B]), SPI1_CS (bidir, see GPIO[4B]), SPI1_MISO (bidir, see GPIO[1B]), SPI1_MOSI (bidir, see GPIO[1B]), STATUS_LED (bidir, see GPIO[1C]), TWI0_SCL (bidir, see GPIO[1A]), TWI0_SDA (bidir, see GPIO[1A]), UART3_RX (bidir, see GPIO[1A]), UART3_TX (bidir, see GPIO[1A]), USB0_DRVVBUS (bidir, see TF-USB[4A]), WIFI_PWR_EN (bidir, see Wi-Fi[6A]), WL_REG_ON (bidir, see Wi-Fi[2B]), WL_SDIO_CLK (bidir, see Wi-Fi[1B]), WL_SDIO_CMD (bidir, see Wi-Fi[1B]), WL_SDIO_D0 (bidir, see Wi-Fi[1B]), WL_SDIO_D1 (bidir, see Wi-Fi[1B]), WL_SDIO_D2 (bidir, see Wi-Fi[1B]), WL_SDIO_D3 (bidir, see Wi-Fi[1B]), WL_WAKE_AP (bidir, see Wi-Fi[2B])

### Nets
GND: C43.1 C97.1 C98.1 C99.1 C100.1
VCC_IO: R70.1 U2.R6(VCC-PD)  [also labelled VCC_PD]  [project net ALDO3]
VCC_PC: C97.2 U2.N19(VCC-PC)
VCC_PG: C98.2 C100.2 U2.H6(VCC-PG) U2.M19(VCC-PM)  [also labelled VCC_PM]  [project net VCC_DCXOIO]
VCC_PL: C99.2 U2.H18(VCC-PL)  [project net ALDO1]
AP_WAKE_BT: U2.L22(PM2) ; port AP_WAKE_BT
BT_PCM_CLK: U2.K2(PG11/PCM2-CLK/H-PCM2-CLK/SIM0-CLK/BIST-RESULT0) ; port BT_PCM_CLK
BT_PCM_DIN: U2.L3(PG12/PCM2-DOUT/H-PCM2-DOUT/SIM0-DATA/BIST-RESULT1) ; port BT_PCM_DIN
BT_PCM_DOUT: U2.L4(PG13/PCM2-DIN/H-PCM2-DIN/SIM0-RST/BIST-RESULT2) ; port BT_PCM_DOUT
BT_PCM_SYNC: U2.K3(PG10/PCM2-SYNC/H-PCM2-SYNC/SIM0-PWREN) ; port BT_PCM_SYNC
BT_REG_ON: U2.L19(PM4) ; port BT_REG_ON
BT_UART_CTS: U2.H3(PG8/UART1-RTS/PLL-STA-DB/SIM0-VPPEN) ; port BT_UART_CTS
BT_UART_RTS: U2.K1(PG9/UART1-CTS/PLL-TEST-GPIO/SIM0-VPPPP) ; port BT_UART_RTS
BT_UART_RX: U2.H4(PG6/UART1-TX) ; port BT_UART_RX
BT_UART_TX: U2.J6(PG7/UART1-RX) ; port BT_UART_TX
BT_WAKE_AP: U2.L21(PM1) ; port BT_WAKE_AP
CPUX_URX: U2.D12(PH1/UART0-RX/PCM0-CLK/H-PCM0-CLK/SIM1-VPPPP) ; port CPUX_URX
CPUX_UTX: U2.C9(PH0/UART0-TX/PCM0-SYNC/H-PCM0-SYNC/SIM1-VPPEN) ; port CPUX_UTX
DDC_CEC_EN: U2.E11(PH2/IR-TX/PCM0-DOUT/H-PCM0-DOUT/SIM1-PWREN) ; port DDC_CEC_EN
EMMC_CLK: C43.2 R34.1 ; port EMMC_CLK
EMMC_CMD: U2.M21(PC5/NAND-RB0/SDC2-CMD/SPI0-CS) ; port EMMC_CMD
EMMC_D0: U2.N22(PC6/NAND-DQ0/SDC2-D0/SPI0-HOLD) ; port EMMC_D0
EMMC_D1: U2.N23(PC7/NAND-DQ1/SDC2-D1/SPI0-WP) ; port EMMC_D1
EMMC_D2: U2.R22(PC8/NAND-DQ2/SDC2-D2) ; port EMMC_D2
EMMC_D3: U2.R23(PC9/NAND-DQ3/SDC2-D3) ; port EMMC_D3
EMMC_D4: U2.T22(PC10/NAND-DQ4/SDC2-D4) ; port EMMC_D4
EMMC_D5: U2.T21(PC11/NAND-DQ5/SDC2-D5) ; port EMMC_D5
EMMC_D6: U2.U19(PC12/NAND-DQ6/SDC2-D6) ; port EMMC_D6
EMMC_D7: U2.U21(PC13/NAND-DQ7/SDC2-D7) ; port EMMC_D7
EMMC_DS: U2.R20(PC1/NAND-ALE/SDC2-DS) ; port EMMC_DS
EMMC_RST: R36.1 ; port EMMC_RST
HCEC: U2.E9(PH10/HCEC) ; port HCEC
HSCL: U2.E10(PH8/HSCL) ; port HSCL
HSDA: U2.F7(PH9/HSDA) ; port HSDA
PD15: U2.R3(PD15/LCD0-D21/TS1-DVLD/DMIC-DATA0/CSI-D9) ; port PD15
PD16: U2.R2(PD16/LCD0-D22/TS1-D0/DMIC-DATA1) ; port PD16
PD18: U2.P4(PD18/LCD0-CLK/TS2-ERR/DMIC-DATA3) ; port PD18
PD21: U2.H21(PL10/S-OWC/S-PWM1) U2.H22(PL8/S-PWM0) U2.J20(PL3/S-UART-RX) U2.K22(PL2/S-UART-TX) U2.T3(PD21/LCD0-VSYNC/TS2-D0/UART2-RTS) ; port PL10, port PD21, port S_UART_TX, port S_UART_RX, port PL8  [also labelled PL10, PL8, S_UART_RX, S_UART_TX]
PMU_SCK: U2.K20(PL0/S-RSB-SCK/S-TWI-SCK) ; port PMU_SCK
PMU_SDA: U2.K23(PL1/S-RSB-SDA/S-TWI-SDA) ; port PMU_SDA
PWM0: U2.U2(PD22/PWM0/TS3-CLK/UART2-CTS) ; port PWM0
PWR_LED: U2.K21(PL4/S-JTAG-MS) ; port PWR_LED
REVOVERY: U2.J22(PL5/S-JTAG-CK) ; port REVOVERY
SDC0_CLK: R33.2 ; port SDC0_CLK
SDC0_CMD: U2.G3(PF3/SDC0-CMD/JTAG-DO1) ; port SDC0_CMD
SDC0_D0: U2.F3(PF1/SDC0-D0/JTAG-DI1) ; port SDC0_D0
SDC0_D1: U2.E2(PF0/SDC0-D1/JTAG-MS1) ; port SDC0_D1
SDC0_D2: U2.G2(PF5/SDC0-D2/JTAG-CK1) ; port SDC0_D2
SDC0_D3: U2.F1(PF4/SDC0-D3/UART0-RX) ; port SDC0_D3
SDC0_DET: U2.C8(PF6) ; port SDC0_DET
SPI1_CLK: U2.E12(PH4/SPI1-CLK/PCM0-MCLK/H-PCM0-MCLK/SIM1-DATA) ; port SPI1_CLK
SPI1_CS: U2.D11(PH3/SPI1-CS/PCM0-DIN/H-PCM0-DIN/SIM1-CLK) ; port SPI1_CS
SPI1_MISO: U2.D9(PH6/SPI1-MISO/SPDIF-IN/TWI1-SDA/SIM1-DET) ; port SPI1_MISO
SPI1_MOSI: U2.F9(PH5/SPI1-MOSI/SPDIF-MCLK/TWI1-SCK/SIM1-RST) ; port SPI1_MOSI
STATUS_LED: U2.J21(PL7/S-JTAG-DI) ; port STATUS_LED
TWIO_SCL: U2.U3(PD25/TWI0-SCK/TS3-DVLD/UART3-RTS/JTAG-DO) ; port TWI0_SCL
TWIO_SDA: U2.R5(PD26/TWI0-SDA/TS3-D0/UART3-CTS/JTAG-DI) ; port TWI0_SDA
UART3_RX: U2.V1(PD24/TWI2-SDA/TS3-SYNC/UART3-RX/JTAG-CK) ; port UART3_RX
UART3_TX: U2.U5(PD23/TWI2-SCK/TS3-ERR/UART3-TX/JTAG-MS) ; port UART3_TX
USB0_DRVVBUS: U2.H20(PL6/S-JTAG-DO) ; port USB0_DRVVBUS
WIFI_PWR_EN: U2.F8(PH7/SPDIF-OUT) ; port WIFI_PWR_EN
WL_REG_ON: U2.M22(PM3) ; port WL_REG_ON
WL_SDIO_CLK: R35.2 ; port WL_SDIO_CLK
WL_SDIO_CMD: U2.J3(PG1/SDC1-CMD) ; port WL_SDIO_CMD
WL_SDIO_D0: U2.J5(PG2/SDC1-D0) ; port WL_SDIO_D0
WL_SDIO_D1: U2.H2(PG3/SDC1-D1) ; port WL_SDIO_D1
WL_SDIO_D2: U2.L5(PG4/SDC1-D2) ; port WL_SDIO_D2
WL_SDIO_D3: U2.H5(PG5/SDC1-D3) ; port WL_SDIO_D3
WL_WAKE_AP: U2.L20(PM0) ; port WL_WAKE_AP
NetR33_1: R33.1 U2.F2(PF2/SDC0-CLK/UART0-TX)
NetR34_2: R34.2 U2.N20(PC4/NAND-RE/SDC2-CLK)
NetR35_1: R35.1 U2.J2(PG0/SDC1-CLK)
NetR36_2: R36.2 U2.R19(PC14/NAND-DQS/SDC2-RST)
NetR70_2: R70.2 R71.1
NetR71_2: R71.2 U2.P19(PC15/NAND-CE1)

Not connected (* = marked no-connect by the designer): U2 J19(PL9/S-IR-RX)* L2(PG14/PCM2-MCLK/H-PCM2-MCLK/SIM0-DET/BIST-RESULT3)* L6(PD2/LCD0-D4/TS0-SYNC/CSI-HSYNC/RGMII-RXD1/RMII-RXD1)* M2(PD4/LCD0-D6/TS0-D0/CSI-D0/RGMII-RXCK/RMII-NULL)* M3(PD1/LCD0-D3/TS0-ERR/CSI-MCLK/RGMII-RXD2/RMII-NULL)* M4(PD5/LCD0-D7/TS0-D1/CSI-D1/RGMII-RXCTL/RMII-CRS-DV)* M5(PD3/LCD0-D5/TS0-DVLD/CSI-VSYNC/RGMII-RXD0/RMII-RXD0)* M6(PD10/LCD0-D14/TS0-D6/CSI-D6/RGMII-TXD0/RMII-TXD0)* N2(PD6/LCD0-D10/TS0-D2/CSI-D2/RGMII-NULL/RMII-RXER)* N3(PD0/LCD0-D2/TS0-CLK/CSI-PCLK/RGMII-RXD3/RMII-NULL)* P1(PD11/LCD0-D15/TS0-D7/CSI-D7/RGMII-TXCK/RMII-TXCK)* P2(PD9/LCD0-D13/TS0-D5/CSI-D5/RGMII-TXD1/RMII-TXD1)* P3(PD19/LCD0-DE/TS2-SYNC/UART2-TX/MDC)* P5(PD8/LCD0-D12/TS0-D4/CSI-D4/RGMII-TXD2/RMII-NULL)* P6(PD13/LCD0-D19/TS1-ERR/CSI-SDA/RGMII-CLKIN/RMII-NULL)* P21(PC16/NAND-RB1) P22(PC2/NAND-CLE/SPI0-MOSI)* R21(PC0/NAND-WE/SPI0-CLK)* T1(PD7/LCD0-D11/TS0-D3/CSI-D3/RGMII-TXD3/RMII-NULL)* T2(PD17/LCD0-D23/TS2-CLK/DMIC-DATA2)* T20(PC3/NAND-CE0/SPI0-MISO)* U4(PD14/LCD0-D20/TS1-SYNC/DMIC-CLK/CSI-D8)* V2(PD12/LCD0-D18/TS1-CLK/CSI-SCK/RGMII-TXCTL/RMII-TXEN)* V3(PD20/LCD0-HSYNC/TS2-DVLD/UART2-RX/MDIO)*

### Notes on the sheet
- eMMC
- TF
- Wi-Fi
- BLE
- Debug
- EN HDMI I2C and CEC
- EN Wi-Fi power
- HDMI
- EN USB2.0
- WL_BLE_WAKE
- SoC

### Library data of the parts
C43 = 100nF: as C5 on sheet LPDDR3
C97-C100 = 100nF: as C31 on sheet LPDDR3
R33-R36 = 33Ω: 62.5mW 33Ω 50V ±100ppm/℃ Thick Film Resistor ±1% 0402 Chip Resistor - Surface Mount ROHS
R70 = 1kΩ: 1kΩ 62.5mW 50V ±100ppm/℃ Thick Film Resistor ±1% 0402 Chip Resistor - Surface Mount ROHS
R71 = 10kΩ: 62.5mW 10kΩ 50V ±100ppm/℃ Thick Film Resistor ±1% 0402 Chip Resistor - Surface Mount ROHS
U2 = Allwinner_H6: Add into BOM: yes; Symbol: Allwinner_H6; Device: Allwinner_H6; Convert to PCB: yes

## Sheet eMMC.SchDoc
size A3; SheetNumber: 7; SheetTotal: 10
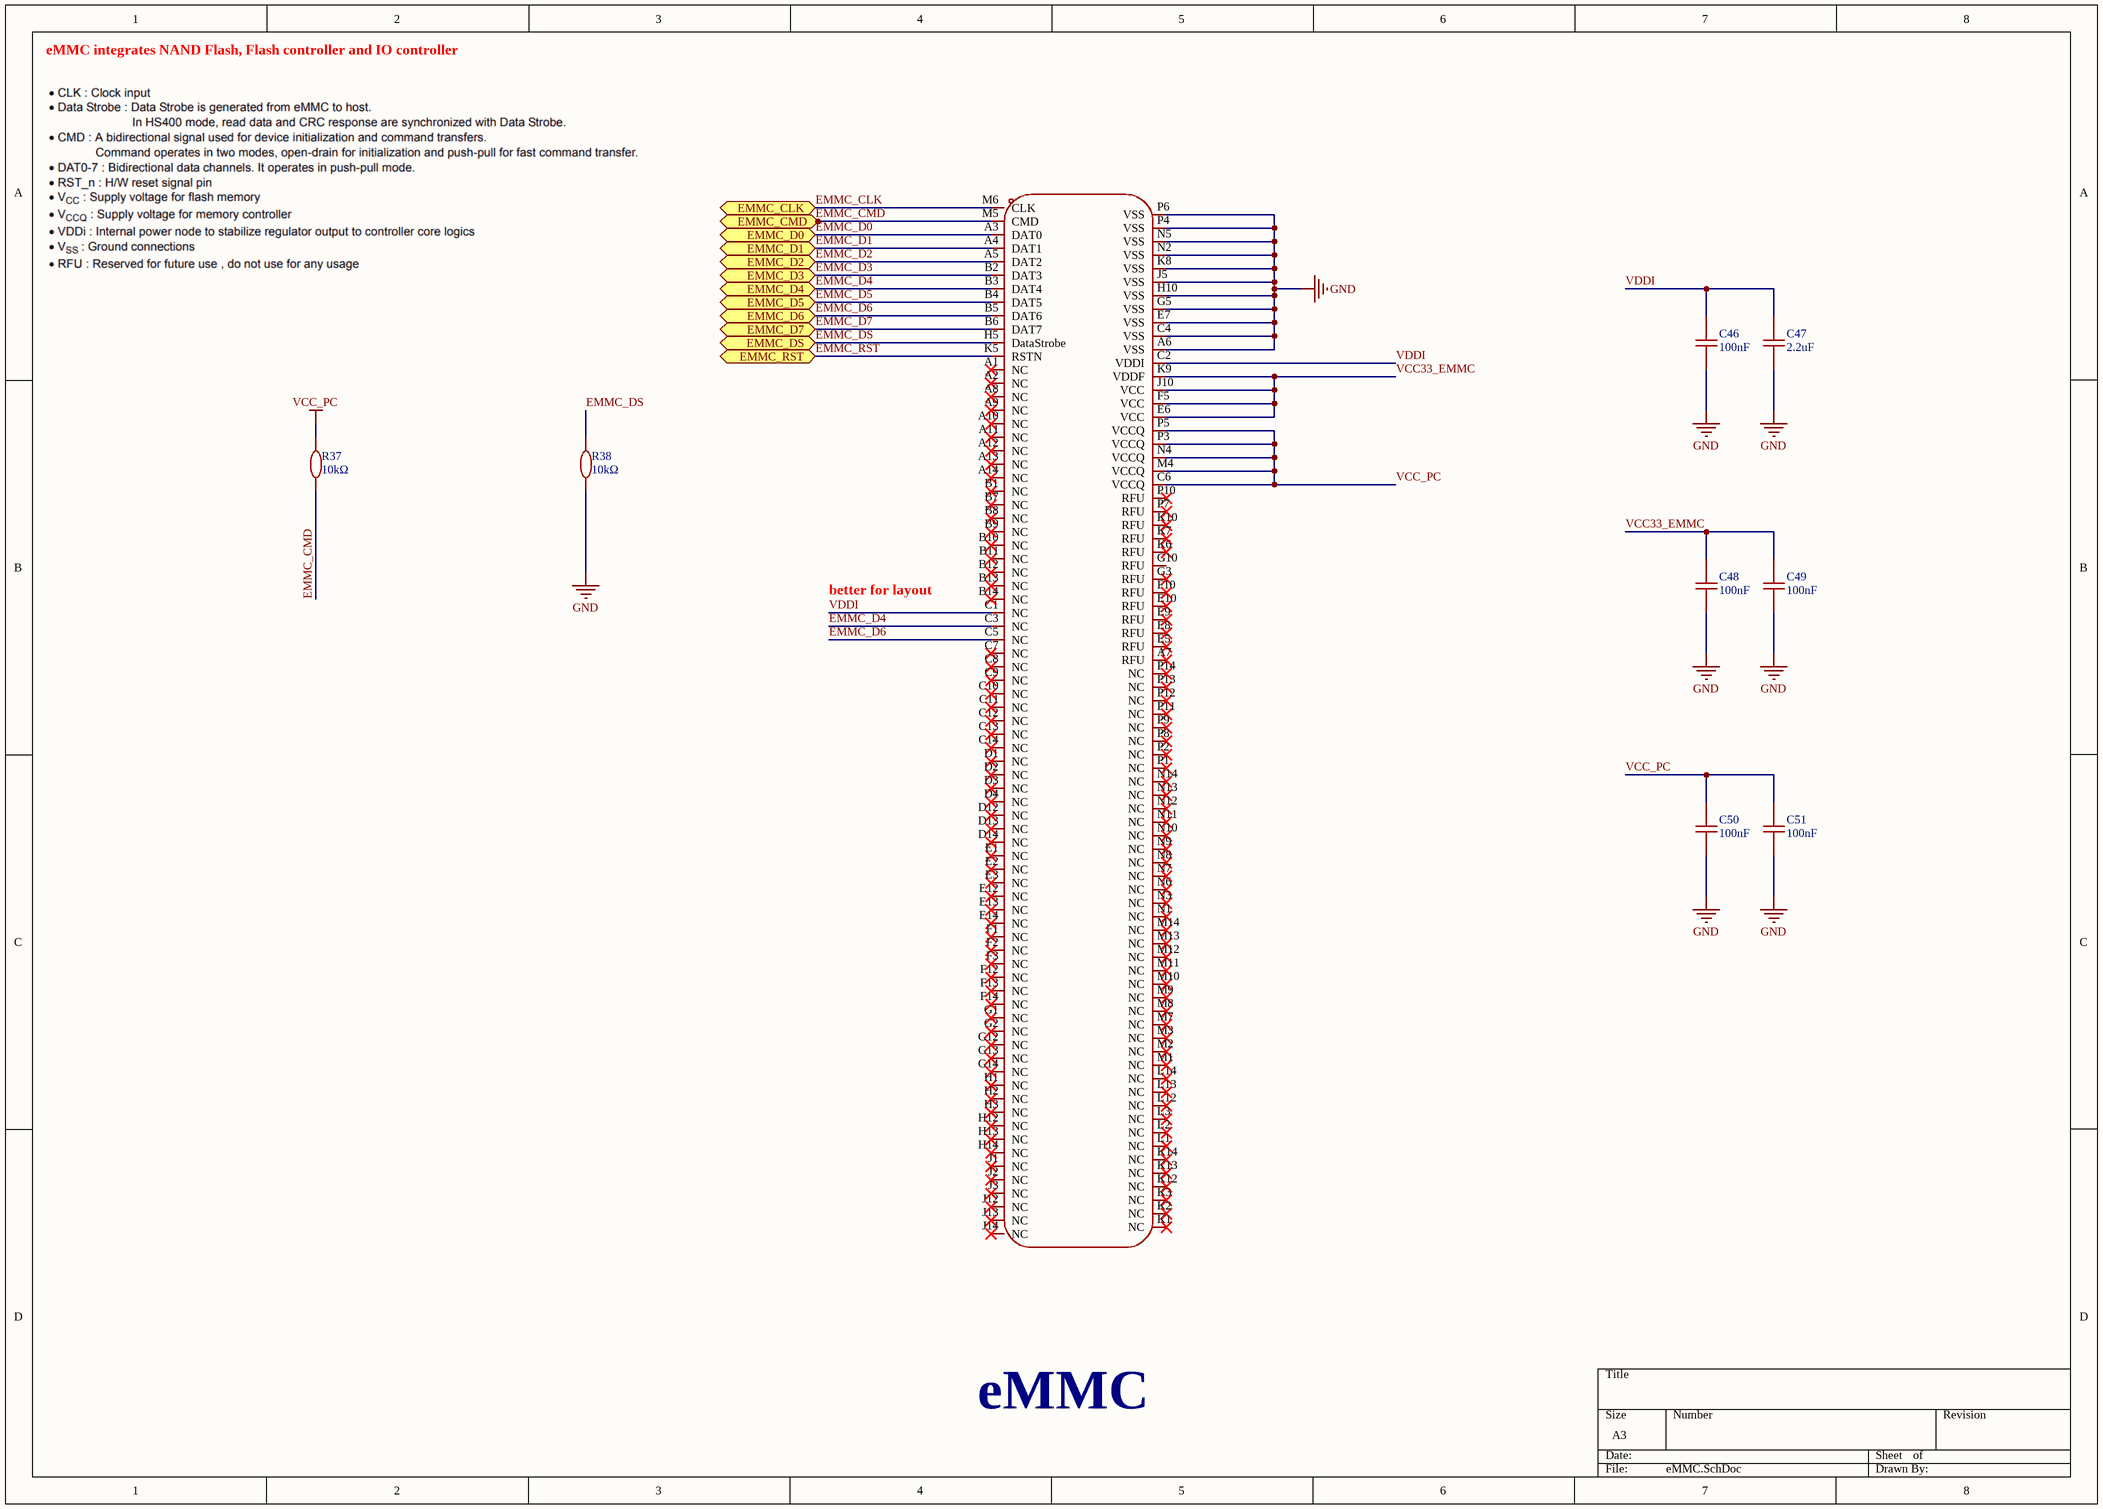
[diagram p3: eMMC.SchDoc]

### Parts
C46  100nF  [C0402]
C47  2.2uF  [C0402]
C48  100nF  [C0402]
C49  100nF  [C0402]
C50  100nF  [C0402]
C51  100nF  [C0402]
R37  10kΩ  [R0402]
R38  10kΩ  [R0402]
U3  KLM8G1GETF-B041  [FBGA-153_L13.0-W11.5-P0.50_KLMAG1JETD-B041]  (value not drawn)

### Ports
EMMC_CLK (bidir, see SoC_1[1A]), EMMC_CMD (bidir, see SoC_1[2A]), EMMC_D0 (bidir, see SoC_1[2A]), EMMC_D1 (bidir, see SoC_1[2B]), EMMC_D2 (bidir, see SoC_1[2B]), EMMC_D3 (bidir, see SoC_1[2B]), EMMC_D4 (bidir, see SoC_1[2B]), EMMC_D5 (bidir, see SoC_1[2B]), EMMC_D6 (bidir, see SoC_1[2B]), EMMC_D7 (bidir, see SoC_1[2B]), EMMC_DS (bidir, see SoC_1[2A]), EMMC_RST (bidir, see SoC_1[1B])

### Nets
GND: C46.1 C47.1 C48.1 C49.1 C50.1 C51.1 R38.1 U3.A6(VSS) U3.C4(VSS) U3.E7(VSS) U3.G5(VSS) U3.H10(VSS) U3.J5(VSS) U3.K8(VSS) U3.N2(VSS) U3.N5(VSS) U3.P4(VSS) U3.P6(VSS)
VCC33_EMMC: C48.2 C49.2 U3.E6(VCC) U3.F5(VCC) U3.J10(VCC) U3.K9(VDDF)  [project net ALDO3]
VCC_PC: C50.2 C51.2 R37.2 U3.C6(VCCQ) U3.M4(VCCQ) U3.N4(VCCQ) U3.P3(VCCQ) U3.P5(VCCQ)
EMMC_CLK: U3.M6(CLK) ; port EMMC_CLK
EMMC_CMD: R37.1 U3.M5(CMD) ; port EMMC_CMD
EMMC_D0: U3.A3(DAT0) ; port EMMC_D0
EMMC_D1: U3.A4(DAT1) ; port EMMC_D1
EMMC_D2: U3.A5(DAT2) ; port EMMC_D2
EMMC_D3: U3.B2(DAT3) ; port EMMC_D3
EMMC_D4: U3.B3(DAT4) U3.C3(NC) ; port EMMC_D4
EMMC_D5: U3.B4(DAT5) ; port EMMC_D5
EMMC_D6: U3.B5(DAT6) U3.C5(NC) ; port EMMC_D6
EMMC_D7: U3.B6(DAT7) ; port EMMC_D7
EMMC_DS: R38.2 U3.H5(DataStrobe) ; port EMMC_DS
EMMC_RST: U3.K5(RSTN) ; port EMMC_RST
VDDI: C46.2 C47.2 U3.C1(NC) U3.C2(VDDI)

Not connected (* = marked no-connect by the designer): U3 A1(NC)* A2(NC)* A7(RFU)* A8(NC)* A9(NC)* A10(NC)* A11(NC)* A12(NC)* A13(NC)* A14(NC)* B1(NC)* B7(NC)* B8(NC)* B9(NC)* B10(NC)* B11(NC)* B12(NC)* B13(NC)* B14(NC)* C7(NC)* C8(NC)* C9(NC)* C10(NC)* C11(NC)* C12(NC)* C13(NC)* C14(NC)* D1(NC)* D2(NC)* D3(NC)* D4(NC)* D12(NC)* D13(NC)* D14(NC)* E1(NC)* E2(NC)* E3(NC)* E5(RFU)* E8(RFU)* E9(RFU)* E10(RFU)* E12(NC)* E13(NC)* E14(NC)* F1(NC)* F2(NC)* F3(NC)* F10(RFU)* F12(NC)* F13(NC)* F14(NC)* G1(NC)* G2(NC)* G3(RFU)* G10(RFU) G12(NC)* G13(NC)* G14(NC)* H1(NC)* H2(NC)* H3(NC)* H12(NC)* H13(NC)* H14(NC)* J1(NC)* J2(NC)* J3(NC)* J12(NC)* J13(NC)* J14(NC)* K1(NC)* K2(NC)* K3(NC)* K6(RFU)* K7(RFU)* K10(RFU)* K12(NC)* K13(NC)* K14(NC)* L1(NC)* L2(NC)* L3(NC)* L12(NC)* L13(NC)* L14(NC)* M1(NC)* M2(NC)* M3(NC)* M7(NC)* M8(NC)* M9(NC)* M10(NC)* M11(NC)* M12(NC)* M13(NC)* M14(NC)* N1(NC)* N3(NC)* N6(NC)* N7(NC)* N8(NC)* N9(NC)* N10(NC)* N11(NC)* N12(NC)* N13(NC)* N14(NC)* P1(NC)* P2(NC)* P7(RFU)* P8(NC)* P9(NC)* P10(RFU)* P11(NC)* P12(NC)* P13(NC)* P14(NC)*

### Notes on the sheet
- eMMC integrates NAND Flash, Flash controller and IO controller
- (near U3) better for layout
- eMMC

### Library data of the parts
C46 C48-C51 = 100nF: as C31 on sheet LPDDR3
C47 = 2.2uF: 16V 2.2uF X5R ±10% 0402 Ceramic Capacitors ROHS
R37 R38 = 10kΩ: as R71 on sheet SoC_1
U3 = KLM8G1GETF-B041_1: 8GB 2.7V~3.6V eMMC 5.1 330/50 MB/s FBGA-153(11.5x13) Memory (ICs) ROHS; Manufacturer: SAMSUNG(三星半导体); Add into BOM: yes; Reading Speed in Sequence: 330MB/S; Writing Speed in Sequence: 50MB/S; Controller Operating Voltage (VCCQ): 2.7V~3.6V；1.7V~1.95V; Symbol: KLM8G1GETF-B041; Device: KLM8G1GETF-B041; LCSC Part Name: KLM8G1GETF-B041; Supplier Part: C499918; Manufacturer Part: KLM8G1GETF-B041; Supplier Footprint: FBGA-153(11.5x13); JLCPCB Part Class: Extended Part; Datasheet: https://item.szlcsc.com/datasheet/KLM8G1GETF-B041/512098.html; Supplier: LCSC; Convert to PCB: yes; configuration: -; Interface: eMMC 5.1; Voltage - Supply: 2.7V~3.6V; Operating Temperature: -25℃~+85℃; Sequential Read/Write (MB/s): 330/50 MB/s; Random Read/Write (IOPS): -; Memory Size: 8GB; NAND Operating Voltage (VCCF): 2.7V~3.6V

## Sheet Power.SchDoc
size A3; SheetNumber: 8; SheetTotal: 10
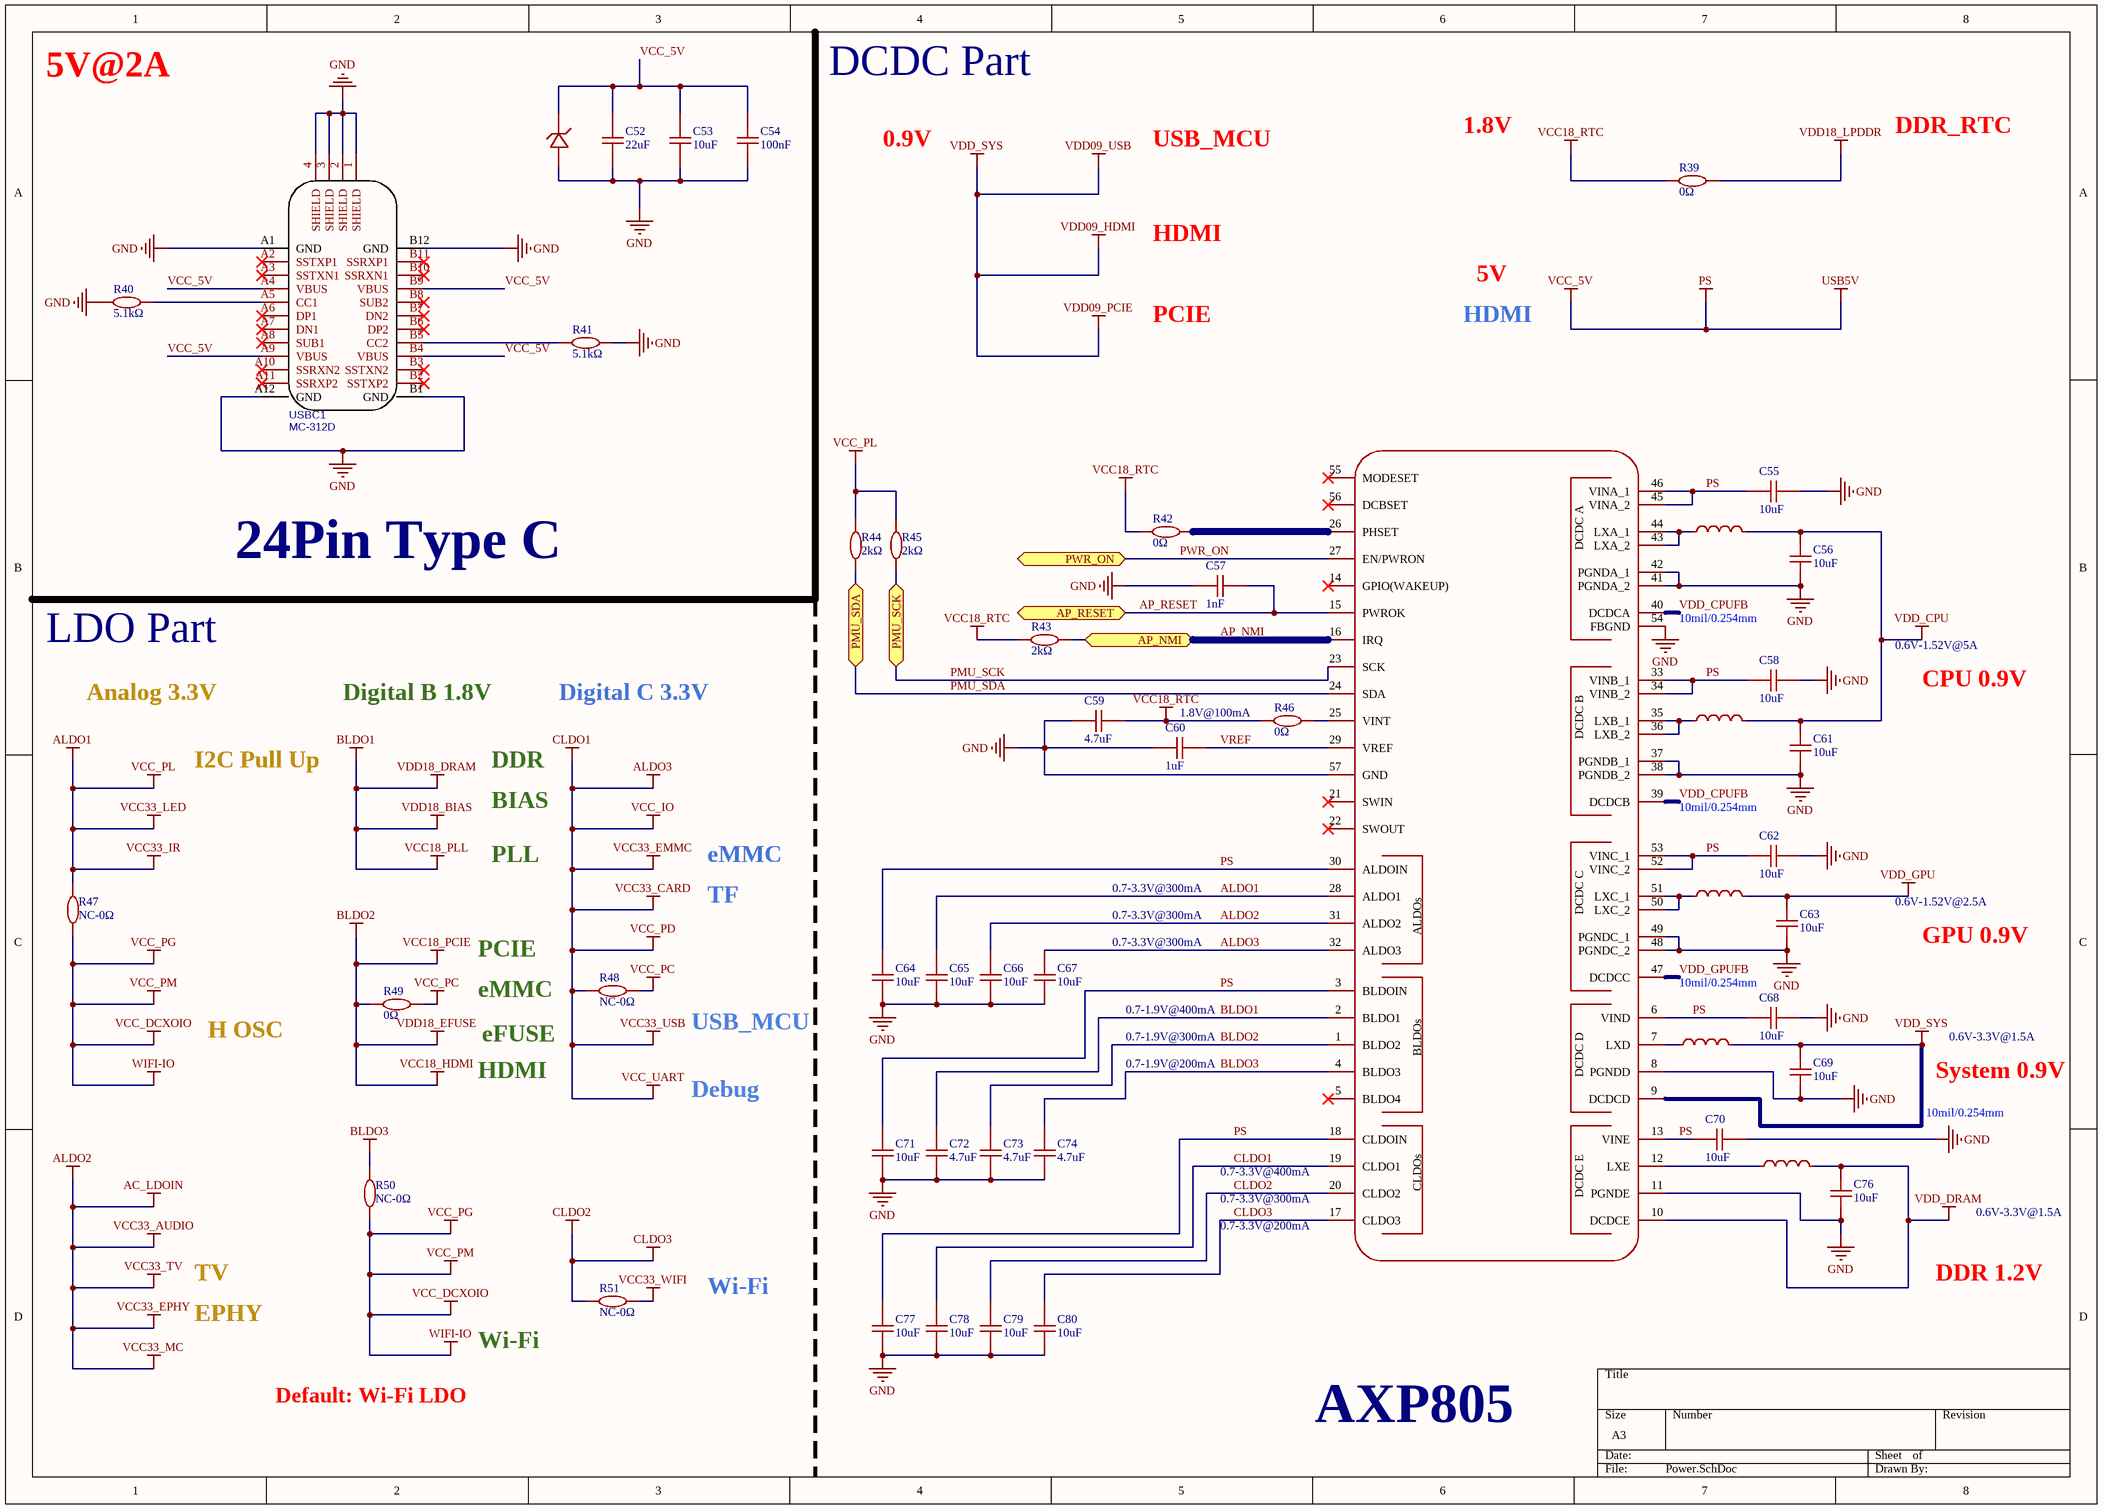
[diagram p4: Power.SchDoc]

### Parts
C52  22uF  [C0603]
C53  10uF  [C0603]
C54  100nF  [C0402]
C55  10uF  [C0603]
C56  10uF  [C0603]
C57  1nF  [C0402]
C58  10uF  [C0603]
C59  4.7uF  [C0402]
C60  1uF  [C0402]
C61  10uF  [C0603]
C62  10uF  [C0603]
C63  10uF  [C0603]
C64  10uF  [C0603]
C65  10uF  [C0603]
C66  10uF  [C0603]
C67  10uF  [C0603]
C68  10uF  [C0603]
C69  10uF  [C0603]
C70  10uF  [C0603]
C71  10uF  [C0603]
C72  4.7uF  [C0402]
C73  4.7uF  [C0402]
C74  4.7uF  [C0402]
C76  10uF  [C0603]
C77  10uF  [C0603]
C78  10uF  [C0603]
C79  10uF  [C0603]
C80  10uF  [C0603]
D5  SMAJ5.0A  [SMA_L4.3-W2.6-LS5.2-RD]  (value not drawn)
L2  1.5uH  [IND-SMD_L4.0-W4.0]  (value not drawn)
L3  1.5uH  [IND-SMD_L4.0-W4.0]  (value not drawn)
L4  1.5uH  [IND-SMD_L4.0-W4.0]  (value not drawn)
L5  1.5uH  [IND-SMD_L4.0-W4.0]  (value not drawn)
L6  1.5uH  [IND-SMD_L4.0-W4.0]  (value not drawn)
R39  0Ω  [R0402]
R40  5.1kΩ  [R0402]
R41  5.1kΩ  [R0402]
R42  0Ω  [R0402]
R43  2kΩ  [R0402]
R44  2kΩ  [R0402]
R45  2kΩ  [R0402]
R46  0Ω  [R0402]
R47  NC-0Ω  [R0402]
R48  NC-0Ω  [R0402]
R49  0Ω  [R0402]
R50  NC-0Ω  [R0402]
R51  NC-0Ω  [R0402]
U4  AXP805  [QFN-56_L7.0-W7.0-P0.40-TL-EP4.6]  (value not drawn)
USBC1  MC-312D  [USB-C-SMD_MC-312D-C]

### Ports
AP_NMI (bidir), AP_RESET (bidir, see GPIO[6C], SoC_2[4A]), PMU_SCK (bidir, see SoC_1[6C]), PMU_SDA (bidir, see SoC_1[6C]), PWR_ON (bidir, see GPIO[5C])

### Nets
ALDO1: C65.2 R44.2 R45.2 R47.2 U4.28(ALDO1)  [also labelled VCC33_IR, VCC33_LED, VCC_PL]
ALDO2: C66.2 U4.31(ALDO2)  [also labelled AC_LDOIN, VCC33_AUDIO, VCC33_EPHY, VCC33_MC, VCC33_TV]
ALDO3: C67.2 C78.2 R48.2 U4.19(CLDO1) U4.32(ALDO3)  [also labelled CLDO1, VCC33_CARD, VCC33_EMMC, VCC33_USB, VCC_IO, VCC_PD, VCC_UART]
BLDO1: C72.2 U4.2(BLDO1)  [also labelled VCC18_PLL, VDD18_BIAS, VDD18_DRAM]
BLDO2: C73.2 R49.1 U4.1(BLDO2)  [also labelled VCC18_HDMI, VCC18_PCIE, VDD18_EFUSE]
BLDO3: C74.2 R50.2 U4.4(BLDO3)
CLDO2: C79.2 C80.2 R51.2 U4.17(CLDO3) U4.20(CLDO2)  [also labelled CLDO3]
GND: C52.1 C53.1 C54.1 C55.1 C56.1 C57.1 C58.1 C59.1 C60.1 C61.1 C62.1 C63.1 C64.1 C65.1 C66.1 C67.1 C68.1 C69.1 C70.1 C71.1 C72.1 C73.1 C74.1 C76.1 C77.1 C78.1 C79.1 C80.1 D5.2(A) R40.1 R41.2 U4.8(PGNDD) U4.11(PGNDE) U4.37(PGNDB_1) U4.38(PGNDB_2) U4.41(PGNDA_2) U4.42(PGNDA_1) U4.48(PGNDC_2) U4.49(PGNDC_1) U4.54(FBGND) U4.57(GND) USBC1.1(SHIELD) USBC1.2(SHIELD) USBC1.3(SHIELD) USBC1.4(SHIELD) USBC1.A1(GND) USBC1.A12(GND) USBC1.B1(GND) USBC1.B12(GND)
PS: C52.2 C53.2 C54.2 C55.2 C58.2 C62.2 C64.2 C68.2 C70.2 C71.2 C77.2 D5.1(C) U4.3(BLDOIN) U4.6(VIND) U4.13(VINE) U4.18(CLDOIN) U4.30(ALDOIN) U4.33(VINB_1) U4.34(VINB_2) U4.45(VINA_2) U4.46(VINA_1) U4.52(VINC_2) U4.53(VINC_1) USBC1.A4(VBUS) USBC1.A9(VBUS) USBC1.B4(VBUS) USBC1.B9(VBUS)  [also labelled USB5V, VCC_5V]
VCC18_RTC: C59.2 R39.1 R42.1 R43.1 R46.1
VCC33_WIFI: R51.1
VCC_DCXOIO: R47.1 R50.1  [also labelled VCC_PG, VCC_PM, WIFI-IO]
VCC_PC: R48.1 R49.2
VDD09_HDMI: C69.2 L5.2 U4.9(DCDCD)  [also labelled VDD09_PCIE, VDD09_USB, VDD_SYS]
VDD18_LPDDR: R39.2
VDD_CPU: C56.2 C61.2 L2.2 L3.2
VDD_DRAM: C76.2 L6.2 U4.10(DCDCE)
VDD_GPU: C63.2 L4.2
AP_NMI: R43.2 U4.16(IRQ) ; port AP_NMI
AP_RESET: C57.2 U4.15(PWROK) ; port AP_RESET
PMU_SCK: R45.1 U4.23(SCK) ; port PMU_SCK
PMU_SDA: R44.1 U4.24(SDA) ; port PMU_SDA
PWR_ON: U4.27(EN/PWRON) ; port PWR_ON
VDD_CPUFB: U4.39(DCDCB) U4.40(DCDCA)
VDD_GPUFB: U4.47(DCDCC)
VREF: C60.2 U4.29(VREF)
NetL2_1: L2.1 U4.43(LXA_2) U4.44(LXA_1)
NetL3_1: L3.1 U4.35(LXB_1) U4.36(LXB_2)
NetL4_1: L4.1 U4.50(LXC_2) U4.51(LXC_1)
NetL5_1: L5.1 U4.7(LXD)
NetL6_1: L6.1 U4.12(LXE)
NetR40_2: R40.2 USBC1.A5(CC1)
NetR41_1: R41.1 USBC1.B5(CC2)
NetR42_2: R42.2 U4.26(PHSET)
NetR46_2: R46.2 U4.25(VINT)

Not connected (* = marked no-connect by the designer): U4 5(BLDO4)* 14(GPIO(WAKEUP))* 21(SWIN)* 22(SWOUT)* 55(MODESET)* 56(DCBSET)*; USBC1 A2(SSTXP1)* A3(SSTXN1)* A6(DP1)* A7(DN1)* A8(SUB1)* A10(SSRXN2)* A11(SSRXP2)* B2(SSTXP2)* B3(SSTXN2)* B6(DP2)* B7(DN2)* B8(SUB2)* B10(SSRXN1)* B11(SSRXP1)*

### Notes on the sheet
- 5V@2A
- DCDC Part
- 0.9V
- USB_MCU
- 1.8V
- DDR_RTC
- HDMI
- 5V
- PCIE
- 24Pin Type C
- LDO Part
- 10mil/0.254mm
- 0.6V-1.52V@5A
- Analog 3.3V
- Digital B 1.8V
- Digital C 3.3V
- 1.8V@100mA
- CPU 0.9V
- I2C Pull Up
- DDR
- BIAS
- PLL
- eMMC
- TF
- 0.7-3.3V@300mA
- 0.6V-1.52V@2.5A
- GPU 0.9V
- H OSC
- eFUSE
- 0.7-1.9V@400mA
- 0.7-1.9V@300mA
- 0.6V-3.3V@1.5A
- Debug
- 0.7-1.9V@200mA
- System 0.9V
- (near U4) 0.7-3.3V@400mA
- (near U4) 0.7-3.3V@300mA
- (near U4) 0.7-3.3V@200mA
- TV
- EPHY
- Wi-Fi
- DDR 1.2V
- Default: Wi-Fi LDO
- AXP805
- (in symbol AXP805) DCDC A; DCDC B; DCDC C; ALDOs; BLDOs; DCDC D; CLDOs; DCDC E

### Library data of the parts
C52 = 22uF: 16V 22uF X5R ±20% 0603 Ceramic Capacitors ROHS
C53 C55 C56 C58 C61-C71 C76-C80 = 10uF: as C1 on sheet LPDDR3
C54 = 100nF: as C31 on sheet LPDDR3
C57 = 1nF: 50V 1nF X7R ±10% 0402 Ceramic Capacitors ROHS
C59 C72-C74 = 4.7uF: 10V 4.7uF X5R ±20% 0402 Ceramic Capacitors ROHS
C60 = 1uF: 50V 1uF X5R ±10% 0402 Ceramic Capacitors ROHS
D5 = SMAJ5.0A_C83329: 43.5A 400W 9.2V 6.4V Unidirectional 5V DO-214AC(SMA) TVS Diodes ROHS; Manufacturer: Littelfuse(美国力特); Symbol: SMAJ5.0A-C83329; Add into BOM: yes; Reverse Leakage Current (Ir): 800uA; Device: SMAJ5.0A_C83329; LCSC Part Name: 耐压/V 5V-440V 峰值脉冲功率 400W; Supplier Part: C83329; Manufacturer Part: SMAJ5.0A; Supplier Footprint: DO-214AC(SMA); JLCPCB Part Class: Extended Part; Datasheet: https://item.szlcsc.com/datasheet/SMAJ5.0A/84493.html; Supplier: LCSC; Convert to PCB: yes; Polarity: Unidirectional; Reverse Stand-Off Voltage (Vrwm): 5V; Clamping Voltage: 9.2V; Peak Pulse Current (Ipp): 43.5A; Peak Pulse Power Dissipation (Ppp): 400W; Voltage - Breakdown: 6.4V; Operating Temperature: -65℃~+150℃; Type: TVS
L2-L6 = SLW4030S1R5NST: 4.15A 1.5uH ±30% 18mΩ SMD,4x4mm Fixed Inductors ROHS; Manufacturer: Sunltech(顺磁); Symbol: SLW4030S1R0NST; Add into BOM: yes; Value: 1uH; Device: SLW4030S1R0NST; LCSC Part Name: 1uH ±30%; Supplier Part: C206354; Manufacturer Part: SLW4030S1R0NST; Supplier Footprint: SMD,4x4mm; JLCPCB Part Class: Extended Part; Datasheet: https://item.szlcsc.com/datasheet/SLW4030S1R0NST/207399.html; Supplier: LCSC; Convert to PCB: yes; Tolerance: ±30%; Current Rating: 4.15A; DC Resistance(DCR): 18mΩ
R39 R42 R46-R51 = 0Ω: 0Ω 62.5mW 50V Thick Film Resistor ±1% 0402 Chip Resistor - Surface Mount ROHS
R40 R41 = 5.1kΩ: 5.1kΩ 62.5mW 50V ±100ppm/℃ Thick Film Resistor ±1% 0402 Chip Resistor - Surface Mount ROHS
R43-R45 = 2kΩ: as R3 on sheet LPDDR3
U4 = AXP805: Add into BOM: yes; Symbol: AXP805; Device: AXP805; Convert to PCB: yes
USBC1 = MC-312D: 1 24P Type-C SMD USB, DVI, HDMI Connector Assemblies ROHS; Manufacturer: SOFNG(硕方); Manufacturer Part: MC-312D-C; Contributor: LCSC; Supplier: LCSC; Supplier Part: C183607; JLCPCB Part Class: Extended Part; spicePre: U; spiceSymbolName: MC-312D